# Altium project KlusterLab r2.0.PrjPcb (part 5 of 10)

## Sheet SFP+_Connectors.SchDoc
size A3; SheetNumber: 16; SheetTotal: 22
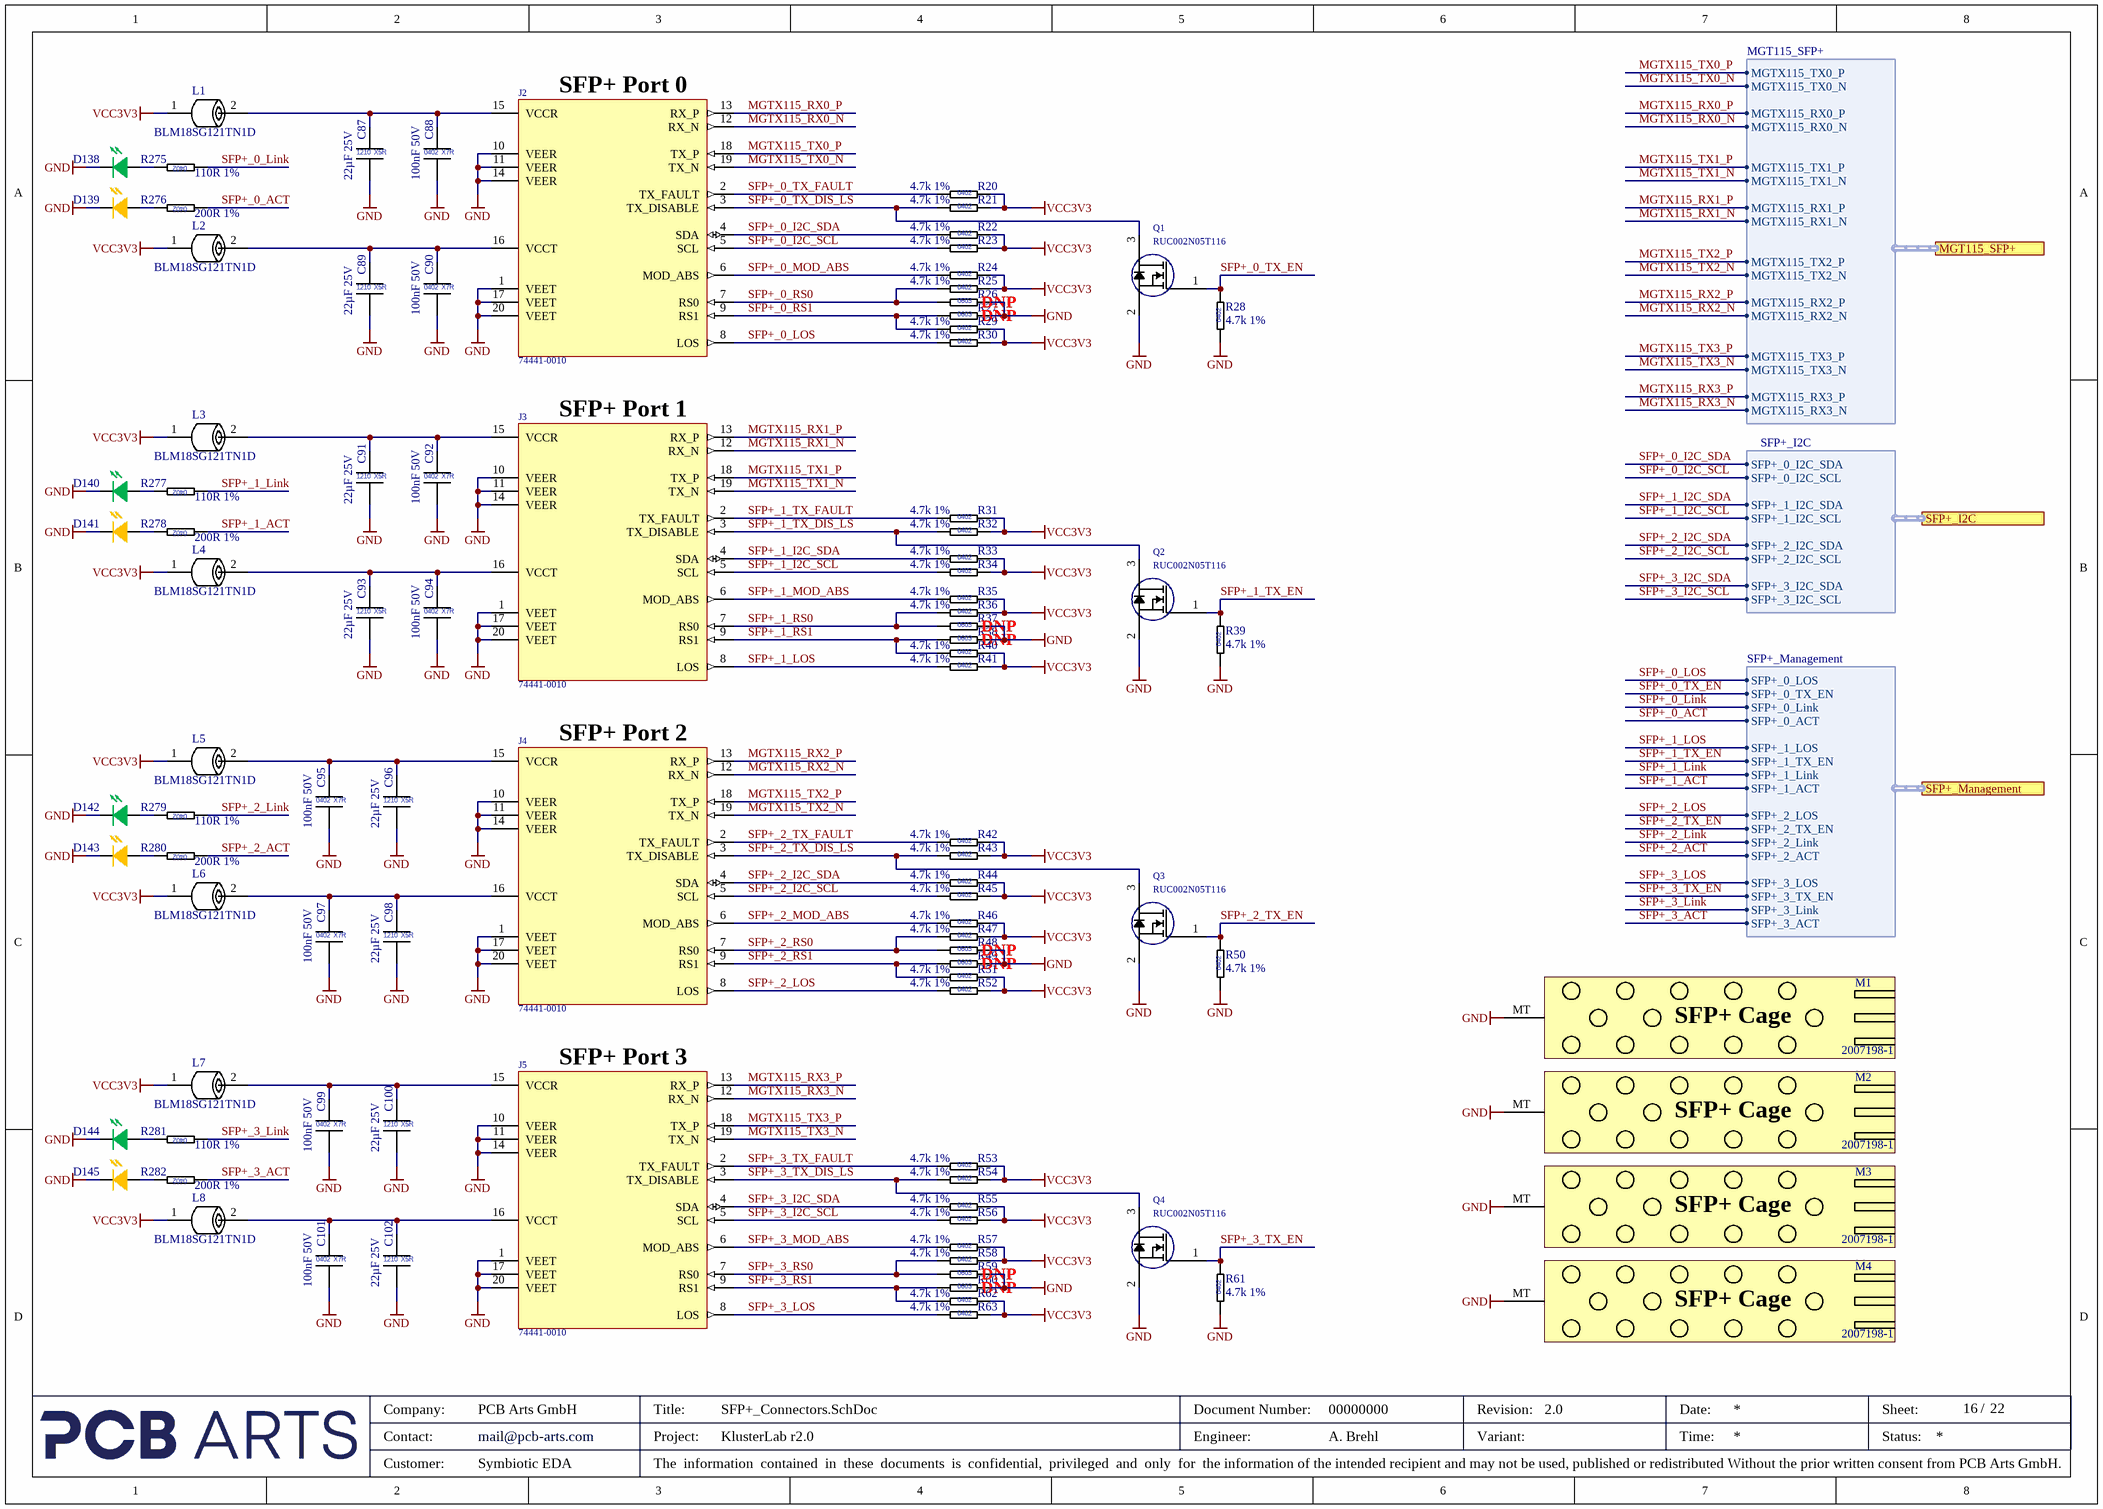
[diagram p9: SFP+_Connectors.SchDoc]

### Parts
C87  22µF 25V  [CAP_1210]
C88  100nF 50V  [CAP_0402_L]
C89  22µF 25V  [CAP_1210]
C90  100nF 50V  [CAP_0402_L]
C91  22µF 25V  [CAP_1210]
C92  100nF 50V  [CAP_0402_L]
C93  22µF 25V  [CAP_1210]
C94  100nF 50V  [CAP_0402_L]
C95  100nF 50V  [CAP_0402_L]
C96  22µF 25V  [CAP_1210]
C97  100nF 50V  [CAP_0402_L]
C98  22µF 25V  [CAP_1210]
C99  100nF 50V  [CAP_0402_L]
C100  22µF 25V  [CAP_1210]
C101  100nF 50V  [CAP_0402_L]
C102  22µF 25V  [CAP_1210]
D138  LTST-S270KGKT  [LED-0603 Sideview]  (value not drawn)
D139  LTST-S270KFKT  [LED-0603 Sideview]  (value not drawn)
D140  LTST-S270KGKT  [LED-0603 Sideview]  (value not drawn)
D141  LTST-S270KFKT  [LED-0603 Sideview]  (value not drawn)
D142  LTST-S270KGKT  [LED-0603 Sideview]  (value not drawn)
D143  LTST-S270KFKT  [LED-0603 Sideview]  (value not drawn)
D144  LTST-S270KGKT  [LED-0603 Sideview]  (value not drawn)
D145  LTST-S270KFKT  [LED-0603 Sideview]  (value not drawn)
J2  74441-0010  [74441-0010]
J3  74441-0010  [74441-0010]
J4  74441-0010  [74441-0010]
J5  74441-0010  [74441-0010]
L1  BLM18SG121TN1D  [L_0603]
L2  BLM18SG121TN1D  [L_0603]
L3  BLM18SG121TN1D  [L_0603]
L4  BLM18SG121TN1D  [L_0603]
L5  BLM18SG121TN1D  [L_0603]
L6  BLM18SG121TN1D  [L_0603]
L7  BLM18SG121TN1D  [L_0603]
L8  BLM18SG121TN1D  [L_0603]
M1  2007198-1  [2007198-1]
M2  2007198-1  [2007198-1]
M3  2007198-1  [2007198-1]
M4  2007198-1  [2007198-1]
Q1  RUC002N05T116  [SOT95P251X112-3N]
Q2  RUC002N05T116  [SOT95P251X112-3N]
Q3  RUC002N05T116  [SOT95P251X112-3N]
Q4  RUC002N05T116  [SOT95P251X112-3N]
R20  4.7k 1%  [RES_0402_L]
R21  4.7k 1%  [RES_0402_L]
R22  4.7k 1%  [RES_0402_L]
R23  4.7k 1%  [RES_0402_L]
R24  4.7k 1%  [RES_0402_L]
R25  4.7k 1%  [RES_0402_L]
R26  0R Jumper  [RES_0603_L]  (value not drawn)  (no BOM)
R27  0R Jumper  [RES_0603_L]  (value not drawn)  (no BOM)
R28  4.7k 1%  [RES_0402_L]
R29  4.7k 1%  [RES_0402_L]
R30  4.7k 1%  [RES_0402_L]
R31  4.7k 1%  [RES_0402_L]
R32  4.7k 1%  [RES_0402_L]
R33  4.7k 1%  [RES_0402_L]
R34  4.7k 1%  [RES_0402_L]
R35  4.7k 1%  [RES_0402_L]
R36  4.7k 1%  [RES_0402_L]
R37  0R Jumper  [RES_0603_L]  (value not drawn)  (no BOM)
R38  0R Jumper  [RES_0603_L]  (value not drawn)  (no BOM)
R39  4.7k 1%  [RES_0402_L]
R40  4.7k 1%  [RES_0402_L]
R41  4.7k 1%  [RES_0402_L]
R42  4.7k 1%  [RES_0402_L]
R43  4.7k 1%  [RES_0402_L]
R44  4.7k 1%  [RES_0402_L]
R45  4.7k 1%  [RES_0402_L]
R46  4.7k 1%  [RES_0402_L]
R47  4.7k 1%  [RES_0402_L]
R48  0R Jumper  [RES_0603_L]  (value not drawn)  (no BOM)
R49  0R Jumper  [RES_0603_L]  (value not drawn)  (no BOM)
R50  4.7k 1%  [RES_0402_L]
R51  4.7k 1%  [RES_0402_L]
R52  4.7k 1%  [RES_0402_L]
R53  4.7k 1%  [RES_0402_L]
R54  4.7k 1%  [RES_0402_L]
R55  4.7k 1%  [RES_0402_L]
R56  4.7k 1%  [RES_0402_L]
R57  4.7k 1%  [RES_0402_L]
R58  4.7k 1%  [RES_0402_L]
R59  0R Jumper  [RES_0603_L]  (value not drawn)  (no BOM)
R60  0R Jumper  [RES_0603_L]  (value not drawn)  (no BOM)
R61  4.7k 1%  [RES_0402_L]
R62  4.7k 1%  [RES_0402_L]
R63  4.7k 1%  [RES_0402_L]
R275  110R 1%  [RES_0402_L]
R276  200R 1%  [RES_0402_L]
R277  110R 1%  [RES_0402_L]
R278  200R 1%  [RES_0402_L]
R279  110R 1%  [RES_0402_L]
R280  200R 1%  [RES_0402_L]
R281  110R 1%  [RES_0402_L]
R282  200R 1%  [RES_0402_L]

### Ports
MGT115_SFP+ (harness MGT115_SFP+, see Top-Level-Sheet[6B], MGT Banks 115-116[8A]), SFP+_I2C (harness SFP+_I2C, see Top-Level-Sheet[6B], I2C Multiplexer[7A]), SFP+_Management (harness SFP+_Management, see Top-Level-Sheet[6B], Bank 13_Bank 15_Bank 16[8C])

### Harnesses
MGT115_SFP+: MGTX115_TX0_P, MGTX115_TX0_N, MGTX115_RX0_P, MGTX115_RX0_N, MGTX115_TX1_P, MGTX115_TX1_N, MGTX115_RX1_P, MGTX115_RX1_N, MGTX115_TX2_P, MGTX115_TX2_N, MGTX115_RX2_P, MGTX115_RX2_N, MGTX115_TX3_P, MGTX115_TX3_N, MGTX115_RX3_P, MGTX115_RX3_N
SFP+_I2C: SFP+_3_I2C_SDA, SFP+_3_I2C_SCL, SFP+_0_I2C_SDA, SFP+_0_I2C_SCL, SFP+_1_I2C_SDA, SFP+_1_I2C_SCL, SFP+_2_I2C_SDA, SFP+_2_I2C_SCL
SFP+_Management: SFP+_0_LOS, SFP+_0_TX_EN, SFP+_0_Link, SFP+_0_ACT, SFP+_1_LOS, SFP+_1_TX_EN, SFP+_1_Link, SFP+_1_ACT, SFP+_2_LOS, SFP+_2_TX_EN, SFP+_2_Link, SFP+_2_ACT, SFP+_3_LOS, SFP+_3_TX_EN, SFP+_3_Link, SFP+_3_ACT

### Nets
GND: C87.2 C88.2 C89.2 C90.2 C91.2 C92.2 C93.2 C94.2 C95.2 C96.2 C97.2 C98.2 C99.2 C100.2 C101.2 C102.2 D138.1 D139.1 D140.1 D141.1 D142.1 D143.1 D144.1 D145.1 J2.1(VEET) J2.10(VEER) J2.11(VEER) J2.14(VEER) J2.17(VEET) J2.20(VEET) J3.1(VEET) J3.10(VEER) J3.11(VEER) J3.14(VEER) J3.17(VEET) J3.20(VEET) J4.1(VEET) J4.10(VEER) J4.11(VEER) J4.14(VEER) J4.17(VEET) J4.20(VEET) J5.1(VEET) J5.10(VEER) J5.11(VEER) J5.14(VEER) J5.17(VEET) J5.20(VEET) M1.MT M2.MT M3.MT M4.MT Q1.2(D) Q2.2(D) Q3.2(D) Q4.2(D) R26.2 R27.2 R28.1 R37.2 R38.2 R39.1 R48.2 R49.2 R50.1 R59.2 R60.2 R61.1
VCC3V3: L1.1 L2.1 L3.1 L4.1 L5.1 L6.1 L7.1 L8.1 R20.2 R21.2 R22.2 R23.2 R24.2 R25.2 R29.2 R30.2 R31.2 R32.2 R33.2 R34.2 R35.2 R36.2 R40.2 R41.2 R42.2 R43.2 R44.2 R45.2 R46.2 R47.2 R51.2 R52.2 R53.2 R54.2 R55.2 R56.2 R57.2 R58.2 R62.2 R63.2
MGTX115_RX0_N: J2.12(RX_N) ; port MGT115_SFP+.MGTX115_RX0_N
MGTX115_RX0_P: J2.13(RX_P) ; port MGT115_SFP+.MGTX115_RX0_P
MGTX115_RX1_N: J3.12(RX_N) ; port MGT115_SFP+.MGTX115_RX1_N
MGTX115_RX1_P: J3.13(RX_P) ; port MGT115_SFP+.MGTX115_RX1_P
MGTX115_RX2_N: J4.12(RX_N) ; port MGT115_SFP+.MGTX115_RX2_N
MGTX115_RX2_P: J4.13(RX_P) ; port MGT115_SFP+.MGTX115_RX2_P
MGTX115_RX3_N: J5.12(RX_N) ; port MGT115_SFP+.MGTX115_RX3_N
MGTX115_RX3_P: J5.13(RX_P) ; port MGT115_SFP+.MGTX115_RX3_P
MGTX115_TX0_N: J2.19(TX_N) ; port MGT115_SFP+.MGTX115_TX0_N
MGTX115_TX0_P: J2.18(TX_P) ; port MGT115_SFP+.MGTX115_TX0_P
MGTX115_TX1_N: J3.19(TX_N) ; port MGT115_SFP+.MGTX115_TX1_N
MGTX115_TX1_P: J3.18(TX_P) ; port MGT115_SFP+.MGTX115_TX1_P
MGTX115_TX2_N: J4.19(TX_N) ; port MGT115_SFP+.MGTX115_TX2_N
MGTX115_TX2_P: J4.18(TX_P) ; port MGT115_SFP+.MGTX115_TX2_P
MGTX115_TX3_N: J5.19(TX_N) ; port MGT115_SFP+.MGTX115_TX3_N
MGTX115_TX3_P: J5.18(TX_P) ; port MGT115_SFP+.MGTX115_TX3_P
SFP+_0_ACT: R276.1 ; port SFP+_Management.SFP+_0_ACT
SFP+_0_I2C_SCL: J2.5(SCL) R23.1 ; port SFP+_I2C.SFP+_0_I2C_SCL
SFP+_0_I2C_SDA: J2.4(SDA) R22.1 ; port SFP+_I2C.SFP+_0_I2C_SDA
SFP+_0_Link: R275.1 ; port SFP+_Management.SFP+_0_Link
SFP+_0_LOS: J2.8(LOS) R30.1 ; port SFP+_Management.SFP+_0_LOS
SFP+_0_MOD_ABS: J2.6(MOD_ABS) R24.1
SFP+_0_RS0: J2.7(RS0) R25.1 R26.1
SFP+_0_RS1: J2.9(RS1) R27.1 R29.1
SFP+_0_TX_DIS_LS: J2.3(TX_DISABLE) Q1.3(S) R21.1
SFP+_0_TX_EN: Q1.1(G) R28.2 ; port SFP+_Management.SFP+_0_TX_EN
SFP+_0_TX_FAULT: J2.2(TX_FAULT) R20.1
SFP+_1_ACT: R278.1 ; port SFP+_Management.SFP+_1_ACT
SFP+_1_I2C_SCL: J3.5(SCL) R34.1 ; port SFP+_I2C.SFP+_1_I2C_SCL
SFP+_1_I2C_SDA: J3.4(SDA) R33.1 ; port SFP+_I2C.SFP+_1_I2C_SDA
SFP+_1_Link: R277.1 ; port SFP+_Management.SFP+_1_Link
SFP+_1_LOS: J3.8(LOS) R41.1 ; port SFP+_Management.SFP+_1_LOS
SFP+_1_MOD_ABS: J3.6(MOD_ABS) R35.1
SFP+_1_RS0: J3.7(RS0) R36.1 R37.1
SFP+_1_RS1: J3.9(RS1) R38.1 R40.1
SFP+_1_TX_DIS_LS: J3.3(TX_DISABLE) Q2.3(S) R32.1
SFP+_1_TX_EN: Q2.1(G) R39.2 ; port SFP+_Management.SFP+_1_TX_EN
SFP+_1_TX_FAULT: J3.2(TX_FAULT) R31.1
SFP+_2_ACT: R280.1 ; port SFP+_Management.SFP+_2_ACT
SFP+_2_I2C_SCL: J4.5(SCL) R45.1 ; port SFP+_I2C.SFP+_2_I2C_SCL
SFP+_2_I2C_SDA: J4.4(SDA) R44.1 ; port SFP+_I2C.SFP+_2_I2C_SDA
SFP+_2_Link: R279.1 ; port SFP+_Management.SFP+_2_Link
SFP+_2_LOS: J4.8(LOS) R52.1 ; port SFP+_Management.SFP+_2_LOS
SFP+_2_MOD_ABS: J4.6(MOD_ABS) R46.1
SFP+_2_RS0: J4.7(RS0) R47.1 R48.1
SFP+_2_RS1: J4.9(RS1) R49.1 R51.1
SFP+_2_TX_DIS_LS: J4.3(TX_DISABLE) Q3.3(S) R43.1
SFP+_2_TX_EN: Q3.1(G) R50.2 ; port SFP+_Management.SFP+_2_TX_EN
SFP+_2_TX_FAULT: J4.2(TX_FAULT) R42.1
SFP+_3_ACT: R282.1 ; port SFP+_Management.SFP+_3_ACT
SFP+_3_I2C_SCL: J5.5(SCL) R56.1 ; port SFP+_I2C.SFP+_3_I2C_SCL
SFP+_3_I2C_SDA: J5.4(SDA) R55.1 ; port SFP+_I2C.SFP+_3_I2C_SDA
SFP+_3_Link: R281.1 ; port SFP+_Management.SFP+_3_Link
SFP+_3_LOS: J5.8(LOS) R63.1 ; port SFP+_Management.SFP+_3_LOS
SFP+_3_MOD_ABS: J5.6(MOD_ABS) R57.1
SFP+_3_RS0: J5.7(RS0) R58.1 R59.1
SFP+_3_RS1: J5.9(RS1) R60.1 R62.1
SFP+_3_TX_DIS_LS: J5.3(TX_DISABLE) Q4.3(S) R54.1
SFP+_3_TX_EN: Q4.1(G) R61.2 ; port SFP+_Management.SFP+_3_TX_EN
SFP+_3_TX_FAULT: J5.2(TX_FAULT) R53.1
NetC87_1: C87.1 C88.1 J2.15(VCCR) L1.2
NetC89_1: C89.1 C90.1 J2.16(VCCT) L2.2
NetC91_1: C91.1 C92.1 J3.15(VCCR) L3.2
NetC93_1: C93.1 C94.1 J3.16(VCCT) L4.2
NetC95_1: C95.1 C96.1 J4.15(VCCR) L5.2
NetC97_1: C97.1 C98.1 J4.16(VCCT) L6.2
NetC99_1: C99.1 C100.1 J5.15(VCCR) L7.2
NetC101_1: C101.1 C102.1 J5.16(VCCT) L8.2
NetD138_2: D138.2 R275.2
NetD139_2: D139.2 R276.2
NetD140_2: D140.2 R277.2
NetD141_2: D141.2 R278.2
NetD142_2: D142.2 R279.2
NetD143_2: D143.2 R280.2
NetD144_2: D144.2 R281.2
NetD145_2: D145.2 R282.2

### Notes on the sheet
- (near J2) SFP+ Port 0
- DNP
- (near J3) SFP+ Port 1
- (near J4) SFP+ Port 2
- (near J5) SFP+ Port 3
- Company:
- Contact:
- Customer:
- mail@pcb-arts.com
- PCB Arts GmbH
- Title:
- Project:
- The  information  contained  in  these  documents  is  confidential,  privileged  and  only  for  the information of the intended recipient and may not be used, published or redistributed Without the prior written consent from PCB Arts GmbH.
- Engineer:
- Document Number:
- Revision:
- Variant:
- Date:
- Time:
- Sheet:
- Status:
- /
- (in symbol 2007198-1_2SFP+ Cage, 1x1, external EMV springs, no lightpipes) SFP+ Cage
- (in symbol CAP_0402_100nF_50V) 0402; X7R
- (in symbol CAP_1210_22µF_25V) 1210; X5R
- (in symbol RES_0402_4.7k_1%) 0402
- (in symbol RES_0402_110R_1%) 0402
- (in symbol RES_0402_200R 1%) 0402
- (in symbol RES_0603_0R_Jumper) 0603

### Library data of the parts
C87 C89 C91 C93 C96 C98 C100 C102 = CAP_1210_22µF_25V: Multilayer Ceramic Capacitors MLCC - SMD/SMT 1210 25VDC; Manufacturer 1: KEMET; Manufacturer 1 Prt. Nr.: C1210C226K3PACTU; Manufacturer 2 Prt. Nr.: TMK212BBJ226MG-TT; Manufacturer 2: Taiyo Yuden
C88 C90 C92 C94 C95 C97 C99 C101 = CAP_0402_100nF_50V: Multilayer Ceramic Capacitors MLCC - SMD/SMT 0402 50VDC; Manufacturer 1: Murata Electronics; Manufacturer 1 Prt. Nr.: GCM155L8EH104KE07D; Manufacturer 2 Prt. Nr.: UMK105B7104KV-FR; Manufacturer 2: TDK
D138 D140 D142 D144 = LED 0603 Green Sideview: GREEN  0603 Light Emitting Diode; Manufacturer 1: lite-On; Manufacturer 1 Prt. Nr.: LTST-S270KGKT; Color: Green
D139 D141 D143 D145 = LED 0603 ORANGE Sideview: ORANGE 0603 Light Emitting Diode; Manufacturer 1: lite-On; Manufacturer 1 Prt. Nr.: LTST-S270KFKT; Color: Orange
J2-J5 = 74441-0010_Card Edge Connector for SFP+: 20 Pin Right Angle 0.8mm SMD Card Edge Connector for SFP+; Manufacturer 1: Molex; Manufacturer 1 Prt. Nr.: 74441-0010
L1-L8 = BLM18SG121TN1D_Ferrite Beads 0603 120Ohms 3000mA: Ferritperlen BLM18_xN 0603 100MHz 120Ohm 3000mA 25mOhm RSER; Manufacturer 1: Murata Electronics; Manufacturer 1 Prt. Nr.: BLM18SG121TN1D
M1-M4 = 2007198-1_2SFP+ Cage, 1x1, external EMV springs, no lightpipes: 2SFP+ Cage, 1x1, external EMV springs, no lightpipes; Manufacturer 1: TE Connectivity; Manufacturer 1 Prt. Nr.: 2007198-1
Q1-Q4 = RUC002N05T116_MOSFET N-Ch 1.2 VGS Spec: MOSFET N-Ch 1.2 VGS Spec; Manufacturer 1: ROHM Semiconductor; Manufacturer 1 Prt. Nr.: RUC002N05T116
R20-R25 R28-R36 R39-R47 R50-R58 R61-R63 = RES_0402_4.7k_1%: Thick Film Resistors - SMD 4.7kOhm 1%; Manufacturer 1: Vishay / Dale; Manufacturer 1 Prt. Nr.: CRCW04024K70FKEDC; Manufacturer 2 Prt. Nr.: RC0402FR-134K7L; Manufacturer 2: Yageo
R26 R27 R37 R38 R48 R49 R59 R60 = RES_0603_0R_Jumper: Thick Film Resistors - SMD 0Ohm Jumper; Manufacturer 1: Yageo; Manufacturer 1 Prt. Nr.: RC0603JR-100RL; Manufacturer 2 Prt. Nr.: CRCW06030000Z0EBC; Manufacturer 2: Vishay / Draloric
R275 R277 R279 R281 = RES_0402_110R_1%: Thick Film Resistors - SMD 110Ohm 1%; Manufacturer 1: Vishay / Dale; Manufacturer 1 Prt. Nr.: CRCW0402110RFKTD; Manufacturer 2 Prt. Nr.: RC0402FR-7W110RL; Manufacturer 2: Yageo
R276 R278 R280 R282 = RES_0402_200R 1%: Thick Film Resistors - SMD 200Ohm 1%; Manufacturer 1: Vishay / Dale; Manufacturer 1 Prt. Nr.: CRCW0402200RFKEDC; Manufacturer 2 Prt. Nr.: AF0402FR-07200RL; Manufacturer 2: Yageo

## Sheet SMI Bank 12.SchDoc
size A3; SheetNumber: 26; SheetTotal: 32
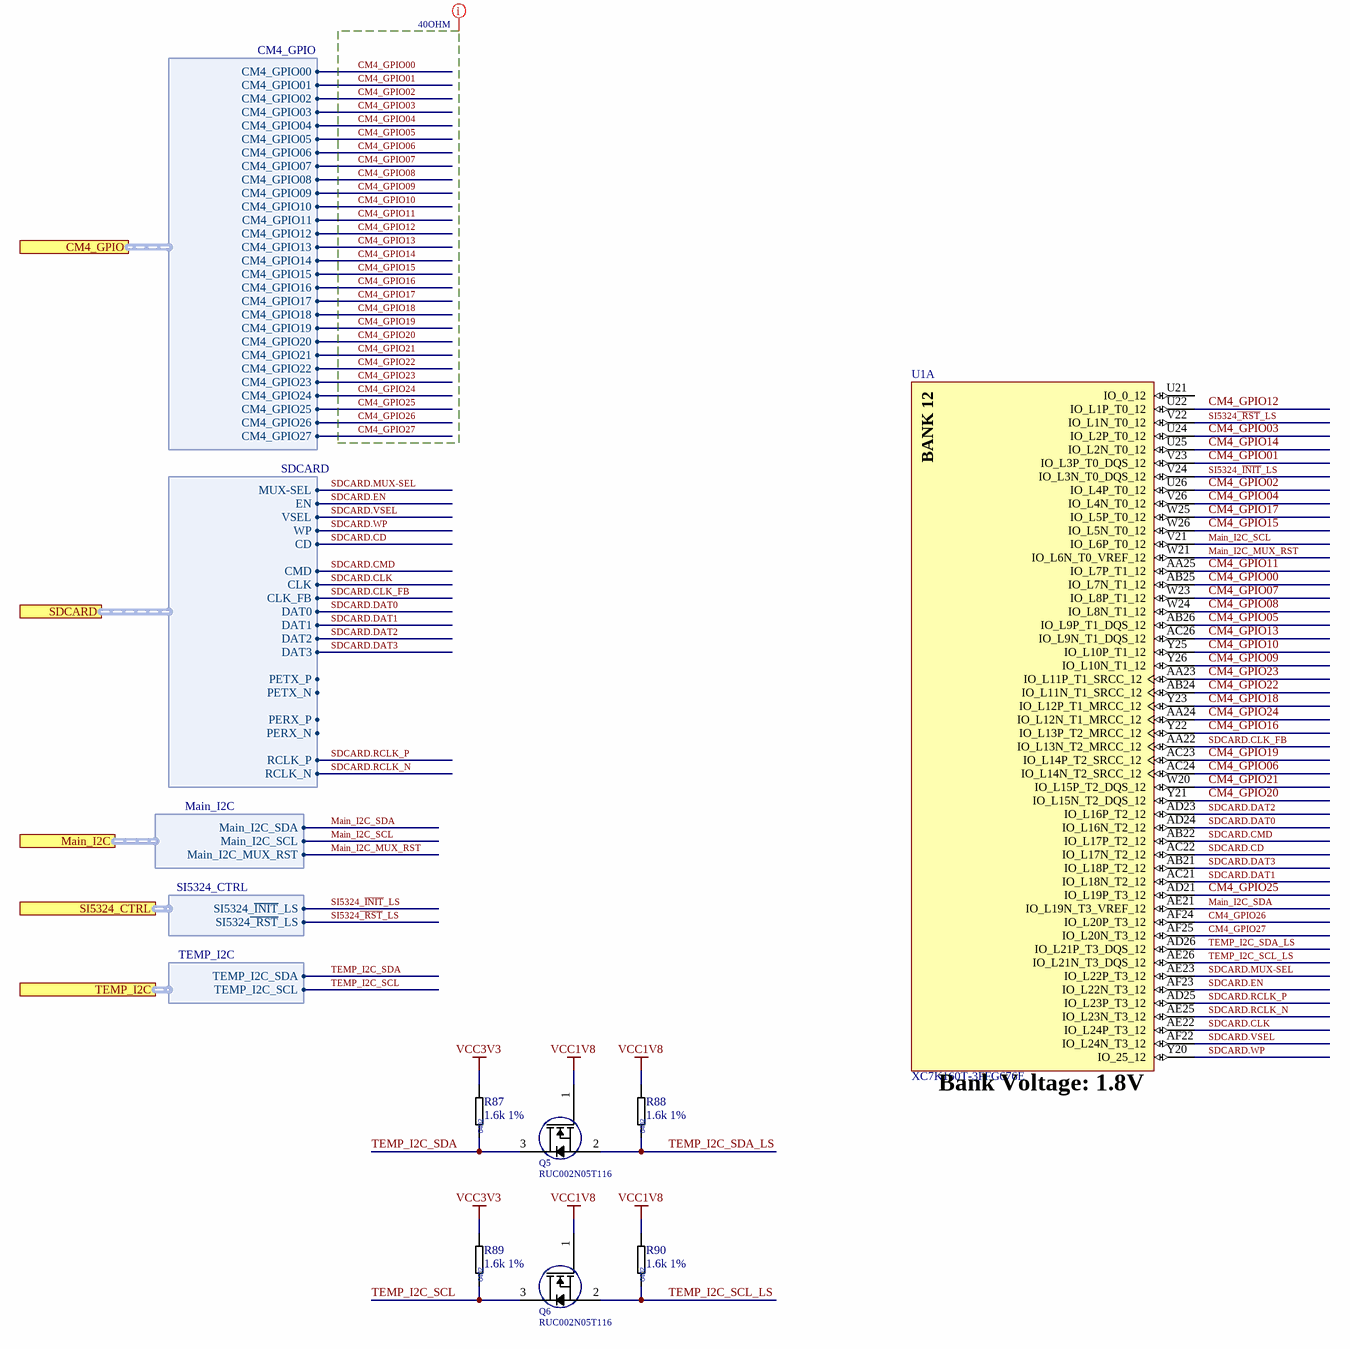
[diagram p10: SMI Bank 12.SchDoc]

### Parts
Q5  RUC002N05T116  [SOT95P251X112-3N]
Q6  RUC002N05T116  [SOT95P251X112-3N]
R87  1.6k 1%  [RES_0402_L]
R88  1.6k 1%  [RES_0402_L]
R89  1.6k 1%  [RES_0402_L]
R90  1.6k 1%  [RES_0402_L]
U1  XC7K160T-3FFG676E  [BGA100P2700X2700X317-676N]  (part A of 14)

### Ports
CM4_GPIO (harness CM4_GPIO, see Top-Level-Sheet[4B], Raspberry Pi CM4[8D]), Main_I2C (harness Main_I2C, see Top-Level-Sheet[4B], I2C Multiplexer[1A]), SDCARD (harness SDCARD, see Top-Level-Sheet[4B], Memory-SD_UHS_II[1C], MGT Banks 115-116[8B]), SI5324_CTRL (harness SI5324_CTRL, see Top-Level-Sheet[4B], System Clocks[1A]), TEMP_I2C (harness TEMP_I2C, see Top-Level-Sheet[4B], Power-Tree[1D])

### Harnesses
Main_I2C: Main_I2C_SCL, Main_I2C_MUX_RST, Main_I2C_SDA
SI5324_CTRL: SI5324_~{INIT}_LS, SI5324~{_RST}_LS
TEMP_I2C: TEMP_I2C_SCL, TEMP_I2C_SDA
CM4_GPIO: CM4_GPIO06, CM4_GPIO05, CM4_GPIO08, CM4_GPIO07, CM4_GPIO04, CM4_GPIO03, CM4_GPIO02, CM4_GPIO00, CM4_GPIO01, CM4_GPIO09, CM4_GPIO10, CM4_GPIO11, CM4_GPIO12, CM4_GPIO13, CM4_GPIO14, CM4_GPIO15, CM4_GPIO16, CM4_GPIO17, CM4_GPIO18, CM4_GPIO19, CM4_GPIO20, CM4_GPIO21, CM4_GPIO22, CM4_GPIO23, CM4_GPIO24, CM4_GPIO25, CM4_GPIO26, CM4_GPIO27
SDCARD: MUX-SEL, EN, VSEL, WP, CD, CMD, CLK, CLK_FB, PETX_P, PETX_N, DAT0, DAT1, DAT2, DAT3, PERX_P, PERX_N, RCLK_P, RCLK_N

### Nets
VCC1V8: Q5.1(G) Q6.1(G) R88.2 R90.2
VCC3V3: R87.2 R89.2
CM4_GPIO00: U1.AB25(IO_L7N_T1_12) ; port CM4_GPIO.CM4_GPIO00
CM4_GPIO01: U1.V23(IO_L3P_T0_DQS_12) ; port CM4_GPIO.CM4_GPIO01
CM4_GPIO02: U1.U26(IO_L4P_T0_12) ; port CM4_GPIO.CM4_GPIO02
CM4_GPIO03: U1.U24(IO_L2P_T0_12) ; port CM4_GPIO.CM4_GPIO03
CM4_GPIO04: U1.V26(IO_L4N_T0_12) ; port CM4_GPIO.CM4_GPIO04
CM4_GPIO05: U1.AB26(IO_L9P_T1_DQS_12) ; port CM4_GPIO.CM4_GPIO05
CM4_GPIO06: U1.AC24(IO_L14N_T2_SRCC_12) ; port CM4_GPIO.CM4_GPIO06
CM4_GPIO07: U1.W23(IO_L8P_T1_12) ; port CM4_GPIO.CM4_GPIO07
CM4_GPIO08: U1.W24(IO_L8N_T1_12) ; port CM4_GPIO.CM4_GPIO08
CM4_GPIO09: U1.Y26(IO_L10N_T1_12) ; port CM4_GPIO.CM4_GPIO09
CM4_GPIO10: U1.Y25(IO_L10P_T1_12) ; port CM4_GPIO.CM4_GPIO10
CM4_GPIO11: U1.AA25(IO_L7P_T1_12) ; port CM4_GPIO.CM4_GPIO11
CM4_GPIO12: U1.U22(IO_L1P_T0_12) ; port CM4_GPIO.CM4_GPIO12
CM4_GPIO13: U1.AC26(IO_L9N_T1_DQS_12) ; port CM4_GPIO.CM4_GPIO13
CM4_GPIO14: U1.U25(IO_L2N_T0_12) ; port CM4_GPIO.CM4_GPIO14
CM4_GPIO15: U1.W26(IO_L5N_T0_12) ; port CM4_GPIO.CM4_GPIO15
CM4_GPIO16: U1.Y22(IO_L13P_T2_MRCC_12) ; port CM4_GPIO.CM4_GPIO16
CM4_GPIO17: U1.W25(IO_L5P_T0_12) ; port CM4_GPIO.CM4_GPIO17
CM4_GPIO18: U1.Y23(IO_L12P_T1_MRCC_12) ; port CM4_GPIO.CM4_GPIO18
CM4_GPIO19: U1.AC23(IO_L14P_T2_SRCC_12) ; port CM4_GPIO.CM4_GPIO19
CM4_GPIO20: U1.Y21(IO_L15N_T2_DQS_12) ; port CM4_GPIO.CM4_GPIO20
CM4_GPIO21: U1.W20(IO_L15P_T2_DQS_12) ; port CM4_GPIO.CM4_GPIO21
CM4_GPIO22: U1.AB24(IO_L11N_T1_SRCC_12) ; port CM4_GPIO.CM4_GPIO22
CM4_GPIO23: U1.AA23(IO_L11P_T1_SRCC_12) ; port CM4_GPIO.CM4_GPIO23
CM4_GPIO24: U1.AA24(IO_L12N_T1_MRCC_12) ; port CM4_GPIO.CM4_GPIO24
CM4_GPIO25: U1.AD21(IO_L19P_T3_12) ; port CM4_GPIO.CM4_GPIO25
CM4_GPIO26: U1.AF24(IO_L20P_T3_12) ; port CM4_GPIO.CM4_GPIO26
CM4_GPIO27: U1.AF25(IO_L20N_T3_12) ; port CM4_GPIO.CM4_GPIO27
Main_I2C_MUX_RST: U1.W21(IO_L6N_T0_VREF_12) ; port Main_I2C.Main_I2C_MUX_RST
Main_I2C_SCL: U1.V21(IO_L6P_T0_12) ; port Main_I2C.Main_I2C_SCL
Main_I2C_SDA: U1.AE21(IO_L19N_T3_VREF_12) ; port Main_I2C.Main_I2C_SDA
SDCARD.CD: U1.AC22(IO_L17N_T2_12) ; port SDCARD.CD
SDCARD.CLK: U1.AE22(IO_L24P_T3_12) ; port SDCARD.CLK
SDCARD.CLK_FB: U1.AA22(IO_L13N_T2_MRCC_12) ; port SDCARD.CLK_FB
SDCARD.CMD: U1.AB22(IO_L17P_T2_12) ; port SDCARD.CMD
SDCARD.DAT0: U1.AD24(IO_L16N_T2_12) ; port SDCARD.DAT0
SDCARD.DAT1: U1.AC21(IO_L18N_T2_12) ; port SDCARD.DAT1
SDCARD.DAT2: U1.AD23(IO_L16P_T2_12) ; port SDCARD.DAT2
SDCARD.DAT3: U1.AB21(IO_L18P_T2_12) ; port SDCARD.DAT3
SDCARD.EN: U1.AF23(IO_L22N_T3_12) ; port SDCARD.EN
SDCARD.MUX-SEL: U1.AE23(IO_L22P_T3_12) ; port SDCARD.MUX-SEL
SDCARD.RCLK_N: U1.AE25(IO_L23N_T3_12) ; port SDCARD.RCLK_N
SDCARD.RCLK_P: U1.AD25(IO_L23P_T3_12) ; port SDCARD.RCLK_P
SDCARD.VSEL: U1.AF22(IO_L24N_T3_12) ; port SDCARD.VSEL
SDCARD.WP: U1.Y20(IO_25_12) ; port SDCARD.WP
SI5324~{_RST}_LS: U1.V22(IO_L1N_T0_12) ; port SI5324_CTRL.SI5324~{_RST}_LS
SI5324_~{INIT}_LS: U1.V24(IO_L3N_T0_DQS_12) ; port SI5324_CTRL.SI5324_~{INIT}_LS
TEMP_I2C_SCL: Q6.3(S) R89.1 ; port TEMP_I2C.TEMP_I2C_SCL
TEMP_I2C_SCL_LS: Q6.2(D) R90.1 U1.AE26(IO_L21N_T3_DQS_12)
TEMP_I2C_SDA: Q5.3(S) R87.1 ; port TEMP_I2C.TEMP_I2C_SDA
TEMP_I2C_SDA_LS: Q5.2(D) R88.1 U1.AD26(IO_L21P_T3_DQS_12)

Not connected (* = marked no-connect by the designer): U1 U21(IO_0_12)

### Layout directives
net class 40OHM: CM4_GPIO00, CM4_GPIO01, CM4_GPIO02, CM4_GPIO03, CM4_GPIO04, CM4_GPIO05, CM4_GPIO06, CM4_GPIO07, CM4_GPIO08, CM4_GPIO09, CM4_GPIO10, CM4_GPIO11, CM4_GPIO12, CM4_GPIO13, CM4_GPIO14, CM4_GPIO15, CM4_GPIO16, CM4_GPIO17, CM4_GPIO18, CM4_GPIO19, CM4_GPIO20, CM4_GPIO21, CM4_GPIO22, CM4_GPIO23, CM4_GPIO24, CM4_GPIO25, CM4_GPIO26, CM4_GPIO27

### Notes on the sheet
- (near U1) Bank Voltage: 1.8V
- Company:
- Contact:
- Customer:
- mail@pcb-arts.com
- PCB Arts GmbH
- Title:
- Project:
- The  information  contained  in  these  documents  is  confidential,  privileged  and  only  for  the information of the intended recipient and may not be used, published or redistributed Without the prior written consent from PCB Arts GmbH.
- Engineer:
- Document Number:
- Revision:
- Variant:
- Date:
- Time:
- Sheet:
- Status:
- /
- (in symbol RES_0402_1.6k_1%) 0402
- (in symbol XC7K160T-3FFG676E_Kintex-7 FPGA, 400 User I/Os, 8 GTX, FFG676, part A) BANK 12

### Library data of the parts
Q5 Q6 = RUC002N05T116_MOSFET N-Ch 1.2 VGS Spec: as Q1-Q4 on sheet SFP+_Connectors; Manufacturer 1 Prt. Nr.: RUC002N05T116
R87-R90 = RES_0402_1.6k_1%: Thick Film Resistors - SMD 1.6kOhm 1%; Manufacturer 1: Vishay / Dale; Manufacturer 1 Prt. Nr.: CRCW04021K60FKEDC; Manufacturer 2 Prt. Nr.: RC0402FR-7W1K6L; Manufacturer 2: Yageo
U1 = XC7K160T-3FFG676E_Kintex-7 FPGA, 400 User I/Os, 8 GTX, FFG676: Kintex-7 FPGA, 400 User I/Os, 8 GTX, 676-Ball BGA, Speed Grade 3, Extended Grade, Pb-Free; Manufacturer 1: Xilinx; Manufacturer 1 Prt. Nr.: XC7K160T-3FFG676E; ComponentLink1URL: http://www.xilinx.com/support/documentation/data_sheets/ds180_7Series_Overview.pdf; ComponentLink2URL: http://www.xilinx.com/support/documentation/user_guides/ug865-Zynq-7000-Pkg-Pinout.pdf; ComponentLink1Description: Datasheet; ComponentLink2Description: Package Specification

## Sheet SSD M.2_B-Key.SchDoc
size A3; SheetNumber: 28; SheetTotal: 31
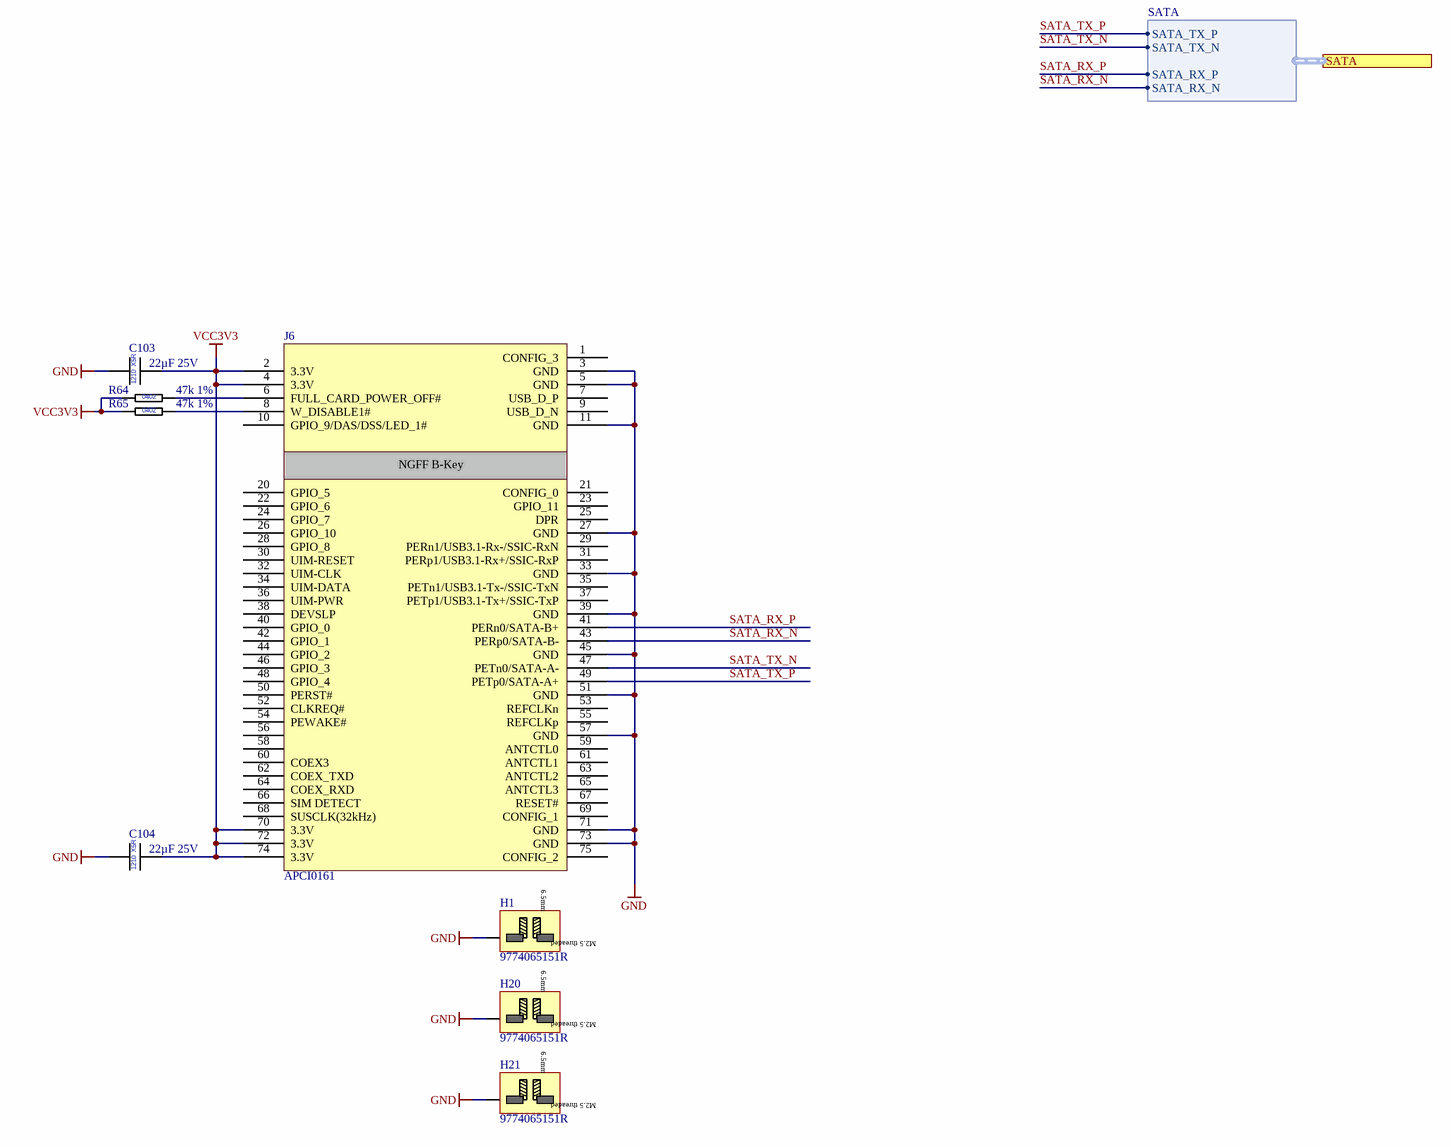
[diagram p11: SSD M.2_B-Key.SchDoc]

### Parts
C103  22µF 25V  [CAP_1210]
C104  22µF 25V  [CAP_1210]
H1  9774065151R  [9774065151R]
H20  9774065151R  [9774065151R]
H21  9774065151R  [9774065151R]
J6  APCI0161  [APCI0161-P001A]
R64  47k 1%  [RES_0402_L]
R65  47k 1%  [RES_0402_L]

### Ports
SATA (harness SATA, see Top-Level-Sheet[6B], MGT Banks 115-116[8C])

### Harnesses
SATA: SATA_TX_P, SATA_TX_N, SATA_RX_P, SATA_RX_N

### Nets
GND: C103.1 C104.1 H1.1 H20.1 H21.1 J6.3(GND) J6.5(GND) J6.11(GND) J6.27(GND) J6.33(GND) J6.39(GND) J6.45(GND) J6.51(GND) J6.57(GND) J6.71(GND) J6.73(GND)
VCC3V3: C103.2 C104.2 J6.2(3.3V) J6.4(3.3V) J6.70(3.3V) J6.72(3.3V) J6.74(3.3V) R64.1 R65.1
SATA_RX_N: J6.43(PERp0/SATA-B-) ; port SATA.SATA_RX_N
SATA_RX_P: J6.41(PERn0/SATA-B+) ; port SATA.SATA_RX_P
SATA_TX_N: J6.47(PETn0/SATA-A-) ; port SATA.SATA_TX_N
SATA_TX_P: J6.49(PETp0/SATA-A+) ; port SATA.SATA_TX_P
NetJ6_6: J6.6(FULL_CARD_POWER_OFF#) R64.2
NetJ6_8: J6.8(W_DISABLE1#) R65.2

Not connected (* = marked no-connect by the designer): J6 1(CONFIG_3) 7(USB_D_P) 9(USB_D_N) 10(GPIO_9/DAS/DSS/LED_1#) 20(GPIO_5) 21(CONFIG_0) 22(GPIO_6) 23(GPIO_11) 24(GPIO_7) 25(DPR) 26(GPIO_10) 28(GPIO_8) 29(PERn1/USB3.1-Rx-/SSIC-RxN) 30(UIM-RESET) 31(PERp1/USB3.1-Rx+/SSIC-RxP) 32(UIM-CLK) 34(UIM-DATA) 35(PETn1/USB3.1-Tx-/SSIC-TxN) 36(UIM-PWR) 37(PETp1/USB3.1-Tx+/SSIC-TxP) 38(DEVSLP) 40(GPIO_0) 42(GPIO_1) 44(GPIO_2) 46(GPIO_3) 48(GPIO_4) 50(PERST#) 52(CLKREQ#) 53(REFCLKn) 54(PEWAKE#) 55(REFCLKp) 56 58 59(ANTCTL0) 60(COEX3) 61(ANTCTL1) 62(COEX_TXD) 63(ANTCTL2) 64(COEX_RXD) 65(ANTCTL3) 66(SIM_DETECT) 67(RESET#) 68(SUSCLK(32kHz)) 69(CONFIG_1) 75(CONFIG_2)

### Notes on the sheet
- Company:
- Contact:
- Customer:
- mail@pcb-arts.com
- PCB Arts GmbH
- Title:
- Project:
- The  information  contained  in  these  documents  is  confidential,  privileged  and  only  for  the information of the intended recipient and may not be used, published or redistributed Without the prior written consent from PCB Arts GmbH.
- Engineer:
- Document Number:
- Revision:
- Variant:
- Date:
- Time:
- Sheet:
- Status:
- /
- (in symbol APCI0161-NGFF B-Key Card Edge Connector 8.5mm Height) NGFF B-Key
- (in symbol CAP_1210_22µF_25V) X5R; 1210
- (in symbol RES_0402_47k_1%) 0402
- (in symbol Würth Standoff M2.5 h:6.5mm) 6.5mm; M2.5 threaded

### Library data of the parts
C103 C104 = CAP_1210_22µF_25V: as C87 on sheet SFP+_Connectors; Manufacturer 2: Taiyo Yuden
H1 H20 H21 = Würth Standoff M2.5 h:6.5mm: Würth Standoff M2.5 h:6.5mm 9774065151R; Manufacturer 1: Würth Elektronik; Manufacturer 1 Prt. Nr.: 9774065151R
J6 = APCI0161-NGFF B-Key Card Edge Connector 8.5mm Height: NGFF B-Key Card Edge Connector 8.5mm Height; Manufacturer 1: Lotes; Manufacturer 1 Prt. Nr.: APCI0161
R64 R65 = RES_0402_47k_1%: Thick Film Resistors - SMD 47kOhm 1%; Manufacturer 1: Vishay / Dale; Manufacturer 1 Prt. Nr.: CRCW040247K0FKEDC; Manufacturer 2 Prt. Nr.: RC0402FR-7W47KL; Manufacturer 2: Yageo

## Sheet USB-HUB-MUX.SchDoc
size A3; SheetNumber: 30; SheetTotal: 32
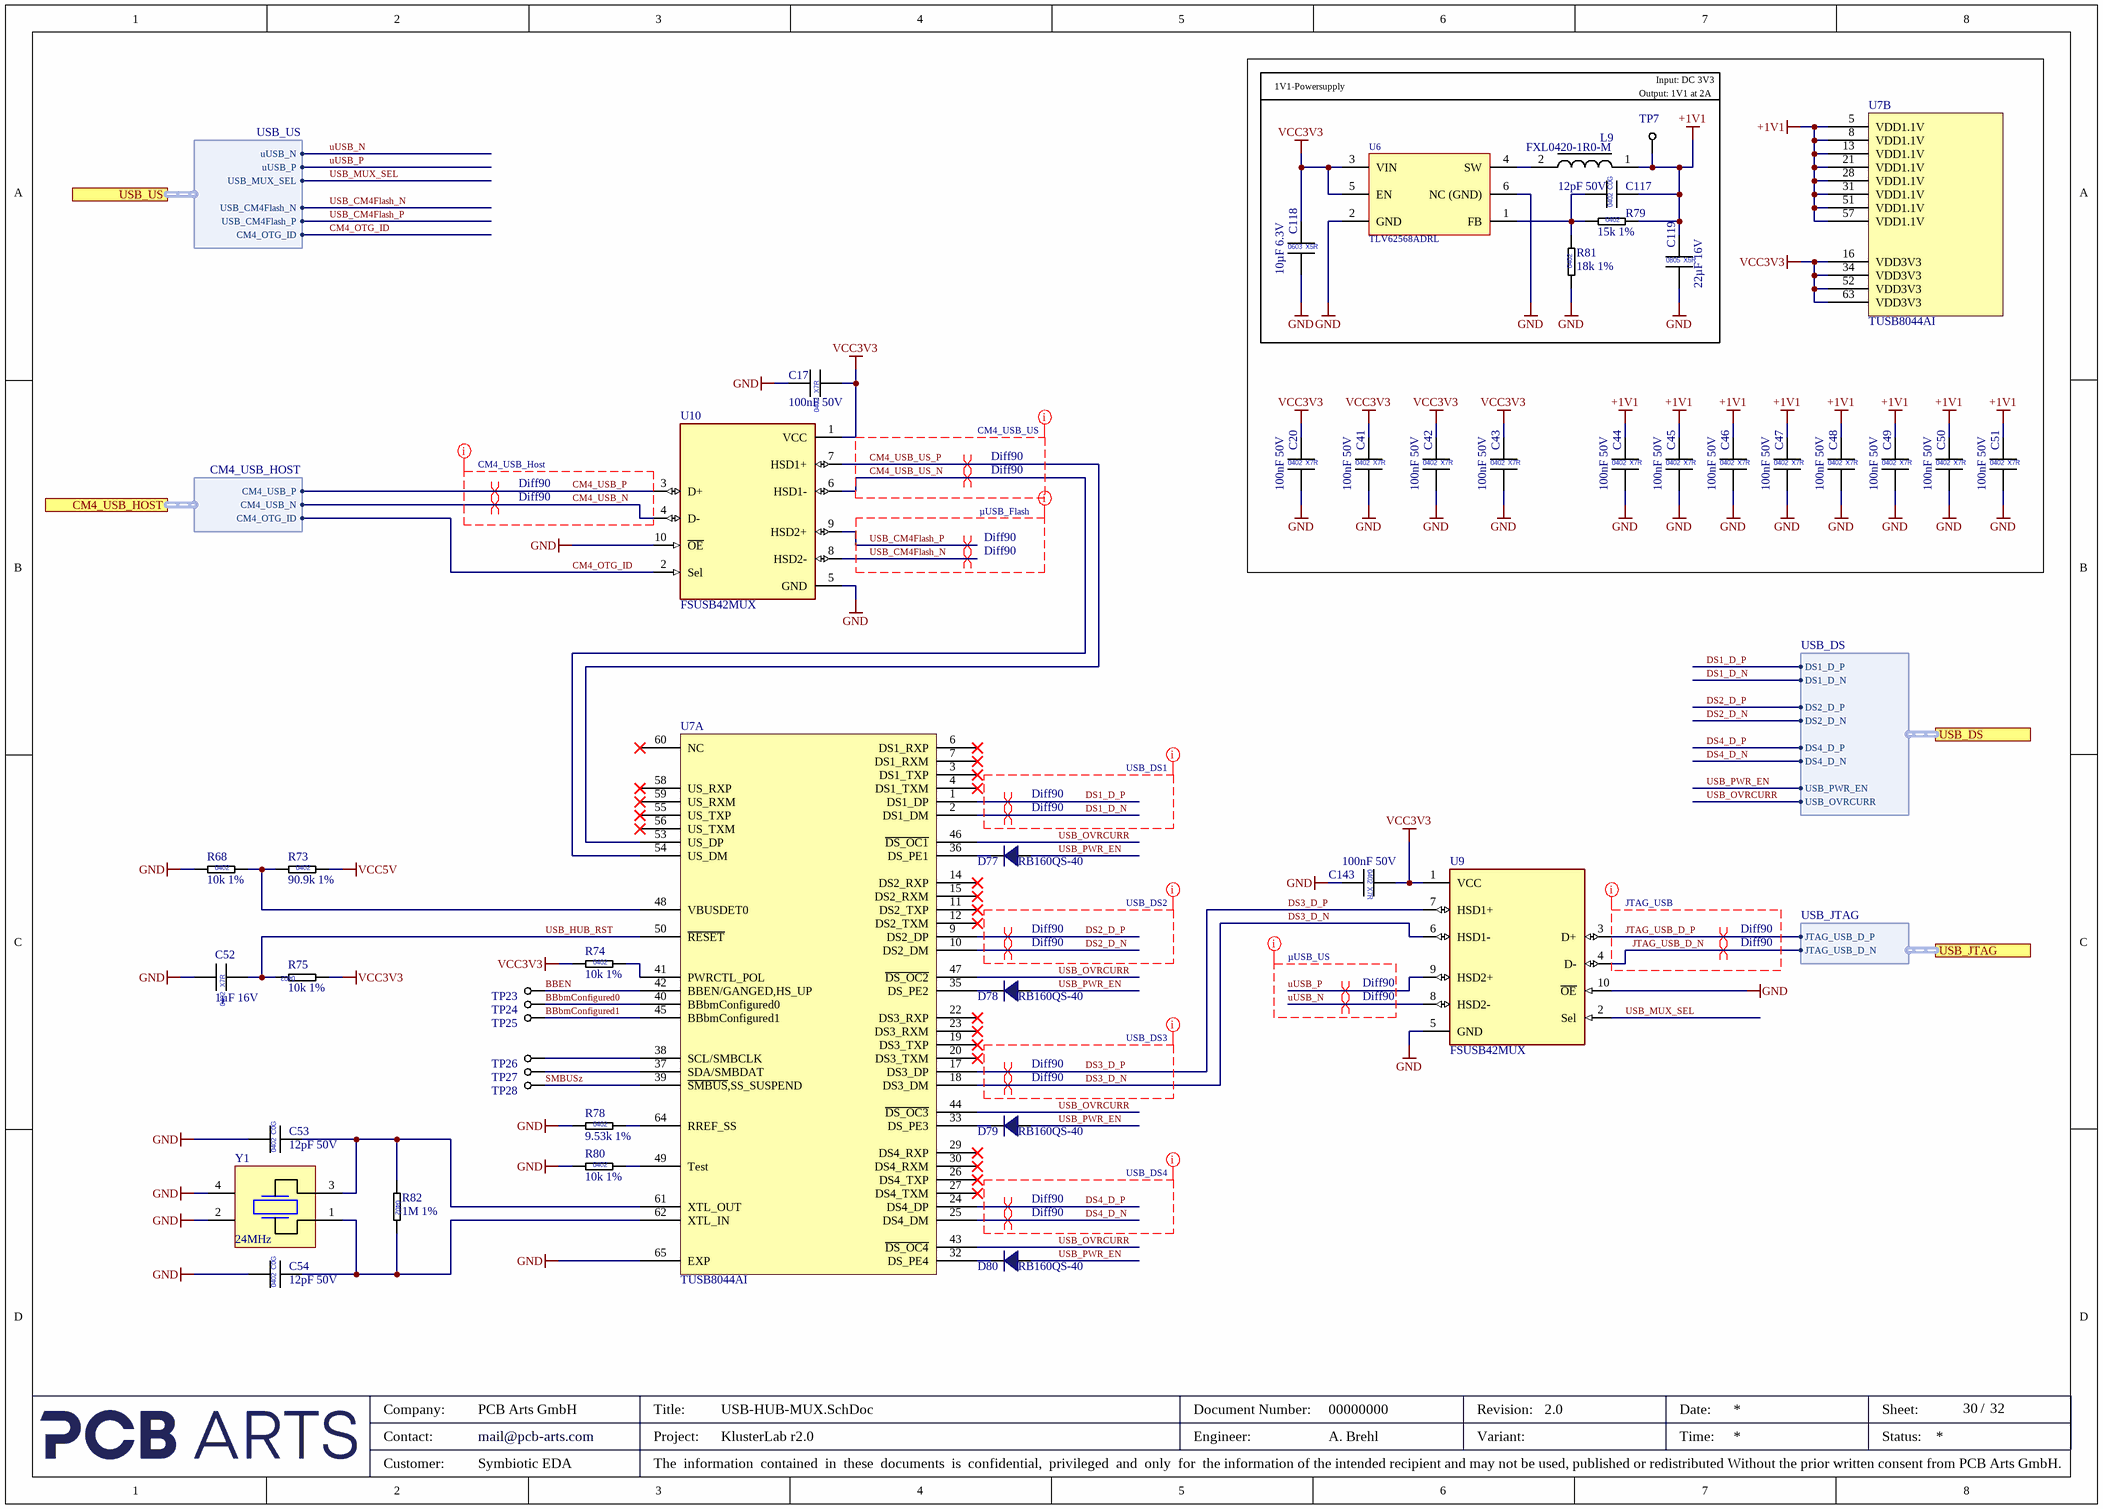
[diagram p12: USB-HUB-MUX.SchDoc]

### Parts
C17  100nF 50V  [CAP_0402_L]
C20  100nF 50V  [CAP_0402_L]
C41  100nF 50V  [CAP_0402_L]
C42  100nF 50V  [CAP_0402_L]
C43  100nF 50V  [CAP_0402_L]
C44  100nF 50V  [CAP_0402_L]
C45  100nF 50V  [CAP_0402_L]
C46  100nF 50V  [CAP_0402_L]
C47  100nF 50V  [CAP_0402_L]
C48  100nF 50V  [CAP_0402_L]
C49  100nF 50V  [CAP_0402_L]
C50  100nF 50V  [CAP_0402_L]
C51  100nF 50V  [CAP_0402_L]
C52  1µF 16V  [CAP_0402_L]
C53  12pF 50V  [CAP_0402_L]
C54  12pF 50V  [CAP_0402_L]
C117  12pF 50V  [CAP_0402_L]
C118  10µF 6.3V  [CAP_0603_L]
C119  22µF 16V  [CAP_0805]
C143  100nF 50V  [CAP_0402_L]
D77  RB160QS-40  [SOD-882]
D78  RB160QS-40  [SOD-882]
D79  RB160QS-40  [SOD-882]
D80  RB160QS-40  [SOD-882]
L9  FXL0420-1R0-M  [FXL0420-1R0-M]
R68  10k 1%  [RES_0402_L]
R73  90.9k 1%  [RES_0402_L]
R74  10k 1%  [RES_0402_L]
R75  10k 1%  [RES_0402_L]
R78  9.53k 1%  [RES_0402_L]
R79  15k 1%  [RES_0402_L]
R80  10k 1%  [RES_0402_L]
R81  18k 1%  [RES_0402_L]
R82  1M 1%  [RES_0402_L]
TP7  Testpoint  [Testpoint 0.8mm]  (value not drawn)  (no BOM)
TP23  Testpoint  [Testpoint 0.8mm]  (value not drawn)  (no BOM)
TP24  Testpoint  [Testpoint 0.8mm]  (value not drawn)  (no BOM)
TP25  Testpoint  [Testpoint 0.8mm]  (value not drawn)  (no BOM)
TP26  Testpoint  [Testpoint 0.8mm]  (value not drawn)  (no BOM)
TP27  Testpoint  [Testpoint 0.8mm]  (value not drawn)  (no BOM)
TP28  Testpoint  [Testpoint 0.8mm]  (value not drawn)  (no BOM)
U6  TLV62568ADRL  [SON50P150X80-6N]
U7  TUSB8044AI  [QFN50P900X900X90_HS-65N]  (parts A,B of 2)
U9  FSUSB42MUX  [SOP50P300X300X110-10N]
U10  FSUSB42MUX  [SOP50P300X300X110-10N]
Y1  Frequency: 24MHz  [ECX-2236B]  (hidden comment: ECS-240-10-36B2-CTN-TR)

### Ports
CM4_USB_HOST (harness CM4_USB_HOST, see Top-Level-Sheet[3B], Raspberry Pi CM4[8C]), USB_DS (harness USB_DS, see Top-Level-Sheet[3B], USB Connectors[8A]), USB_JTAG (harness USB_JTAG, see Top-Level-Sheet[3B], Bank 0_Bank 14[8A]), USB_US (harness USB_US, see Top-Level-Sheet[3B], USB Connectors[4B])

### Harnesses
CM4_USB_HOST: CM4_USB_P, CM4_USB_N, CM4_OTG_ID
USB_JTAG: JTAG_USB_D_P, JTAG_USB_D_N
USB_DS: DS1_D_P, DS1_D_N, DS2_D_P, DS2_D_N, DS4_D_P, DS4_D_N, USB_PWR_EN, USB_OVRCURR
USB_US: USB_MUX_SEL, uUSB_N, uUSB_P, CM4_OTG_ID, USB_CM4Flash_N, USB_CM4Flash_P

### Nets
+1V1: C44.1 C45.1 C46.1 C47.1 C48.1 C49.1 C50.1 C51.1 C117.2 C119.1 L9.1 R79.2 TP7.1(GND) U7.5(VDD1.1V) U7.8(VDD1.1V) U7.13(VDD1.1V) U7.21(VDD1.1V) U7.28(VDD1.1V) U7.31(VDD1.1V) U7.51(VDD1.1V) U7.57(VDD1.1V)
GND: C17.2 C20.2 C41.2 C42.2 C43.2 C44.2 C45.2 C46.2 C47.2 C48.2 C49.2 C50.2 C51.2 C52.2 C53.1 C54.1 C118.2 C119.2 C143.2 R68.1 R78.1 R80.1 R81.1 U6.2(GND) U6.6(NC_(GND)) U7.65(EXP) U9.5(GND) U9.10(~{OE}) U10.5(GND) U10.10(~{OE}) Y1.2 Y1.4
VCC3V3: C17.1 C20.1 C41.1 C42.1 C43.1 C118.1 C143.1 R74.1 R75.2 U6.3(VIN) U6.5(EN) U7.16(VDD3V3) U7.34(VDD3V3) U7.52(VDD3V3) U7.63(VDD3V3) U9.1(VCC) U10.1(VCC)
VCC5V: R73.2
BBbmConfigured0: TP24.1(GND) U7.40(BBbmConfigured0)
BBbmConfigured1: TP25.1(GND) U7.45(BBbmConfigured1)
BBEN: TP23.1(GND) U7.42(BBEN/GANGED,HS_UP)
CM4_OTG_ID: U10.2(Sel) ; port CM4_USB_HOST.CM4_OTG_ID, port USB_US.CM4_OTG_ID
CM4_USB_N: U10.4(D-) ; port CM4_USB_HOST.CM4_USB_N
CM4_USB_P: U10.3(D+) ; port CM4_USB_HOST.CM4_USB_P
CM4_USB_US_N: U7.54(US_DM) U10.6(HSD1-)
CM4_USB_US_P: U7.53(US_DP) U10.7(HSD1+)
DS1_D_N: U7.2(DS1_DM) ; port USB_DS.DS1_D_N
DS1_D_P: U7.1(DS1_DP) ; port USB_DS.DS1_D_P
DS2_D_N: U7.10(DS2_DM) ; port USB_DS.DS2_D_N
DS2_D_P: U7.9(DS2_DP) ; port USB_DS.DS2_D_P
DS3_D_N: U7.18(DS3_DM) U9.6(HSD1-)
DS3_D_P: U7.17(DS3_DP) U9.7(HSD1+)
DS4_D_N: U7.25(DS4_DM) ; port USB_DS.DS4_D_N
DS4_D_P: U7.24(DS4_DP) ; port USB_DS.DS4_D_P
JTAG_USB_D_N: U9.4(D-) ; port USB_JTAG.JTAG_USB_D_N
JTAG_USB_D_P: U9.3(D+) ; port USB_JTAG.JTAG_USB_D_P
SMBUSz: TP28.1(GND) U7.39(~{SMBUS},SS_SUSPEND)
USB_CM4Flash_N: U10.8(HSD2-) ; port USB_US.USB_CM4Flash_N
USB_CM4Flash_P: U10.9(HSD2+) ; port USB_US.USB_CM4Flash_P
USB_HUB_RST: C52.1 R75.1 U7.50(~{RESET})
USB_MUX_SEL: U9.2(Sel) ; port USB_US.USB_MUX_SEL
USB_OVRCURR: U7.43(~{DS_OC4}) U7.44(~{DS_OC3}) U7.46(~{DS_OC1}) U7.47(~{DS_OC2}) ; port USB_DS.USB_OVRCURR
USB_PWR_EN: D77.2 D78.2 D79.2 D80.2 ; port USB_DS.USB_PWR_EN
uUSB_N: U9.8(HSD2-) ; port USB_US.uUSB_N
uUSB_P: U9.9(HSD2+) ; port USB_US.uUSB_P
NetC53_2: C53.2 R82.1 U7.61(XTL_OUT) Y1.3
NetC54_2: C54.2 R82.2 U7.62(XTL_IN) Y1.1
NetC117_1: C117.1 R79.1 R81.2 U6.1(FB)
NetD77_1: D77.1 U7.36(DS_PE1)
NetD78_1: D78.1 U7.35(DS_PE2)
NetD79_1: D79.1 U7.33(DS_PE3)
NetD80_1: D80.1 U7.32(DS_PE4)
NetL9_2: L9.2 U6.4(SW)
NetR68_2: R68.2 R73.1 U7.48(VBUSDET0)
NetR74_2: R74.2 U7.41(PWRCTL_POL)
NetR78_2: R78.2 U7.64(RREF_SS)
NetR80_2: R80.2 U7.49(Test)
NetTP26_1: TP26.1(GND) U7.38(SCL/SMBCLK)
NetTP27_1: TP27.1(GND) U7.37(SDA/SMBDAT)

Not connected (* = marked no-connect by the designer): U7 3(DS1_TXP)* 4(DS1_TXM)* 6(DS1_RXP)* 7(DS1_RXM)* 11(DS2_TXP)* 12(DS2_TXM)* 14(DS2_RXP)* 15(DS2_RXM)* 19(DS3_TXP)* 20(DS3_TXM)* 22(DS3_RXP)* 23(DS3_RXM)* 26(DS4_TXP)* 27(DS4_TXM)* 29(DS4_RXP)* 30(DS4_RXM)* 55(US_TXP)* 56(US_TXM)* 58(US_RXP)* 59(US_RXM)* 60(NC)*

### Layout directives
net class USB_DS4: DS4_D_N, DS4_D_P
differential pair; net class Diff90: CM4_USB_N, CM4_USB_P, CM4_USB_US_N, CM4_USB_US_P, DS1_D_N, DS1_D_P, DS2_D_N, DS2_D_P, DS3_D_N, DS3_D_P, DS4_D_N, DS4_D_P, JTAG_USB_D_N, JTAG_USB_D_P, USB_CM4Flash_N, USB_CM4Flash_P, uUSB_N, uUSB_P
net class USB_DS3: DS3_D_N, DS3_D_P
net class USB_DS2: DS2_D_N, DS2_D_P
net class USB_DS1: DS1_D_N, DS1_D_P
net class µUSB_US: uUSB_N, uUSB_P
net class JTAG_USB: JTAG_USB_D_N, JTAG_USB_D_P
net class µUSB_Flash: USB_CM4Flash_N, USB_CM4Flash_P
net class CM4_USB_Host: CM4_USB_N, CM4_USB_P
net class CM4_USB_US: CM4_USB_US_N, CM4_USB_US_P

### Notes on the sheet
- 1V1-Powersupply
- (near TP7) Output: 1V1 at 2A
- Input: DC 3V3
- Company:
- Contact:
- Customer:
- mail@pcb-arts.com
- PCB Arts GmbH
- Title:
- Project:
- The  information  contained  in  these  documents  is  confidential,  privileged  and  only  for  the information of the intended recipient and may not be used, published or redistributed Without the prior written consent from PCB Arts GmbH.
- Engineer:
- Document Number:
- Revision:
- Variant:
- Date:
- Time:
- Sheet:
- Status:
- /
- (in symbol CAP_0402_1µF_16V) X7R; 0402
- (in symbol CAP_0402_12pF_50V) C0G; 0402
- (in symbol CAP_0402_100nF_50V) 0402; X7R
- (in symbol CAP_0603_10µF_6.3V) 0603; X5R
- (in symbol CAP_0805_22µF_16V) 0805; X5R
- (in symbol RES_0402_1M_1%) 0402
- (in symbol RES_0402_9.53k_1%) 0402
- (in symbol RES_0402_10k_1%) 0402
- (in symbol RES_0402_15k_1%) 0402
- (in symbol RES_0402_18k_1%) 0402
- (in symbol RES_0402_90.9k_1%) 0402

### Library data of the parts
C17 C20 C41-C51 C143 = CAP_0402_100nF_50V: as C88 on sheet SFP+_Connectors; Manufacturer 2: TDK
C52 = CAP_0402_1µF_16V: Multilayer Ceramic Capacitors MLCC - SMD/SMT 0402 16VDC; Manufacturer 1: Taiyo Yuden; Manufacturer 1 Prt. Nr.: EMK105BJ105MVHF; Manufacturer 2 Prt. Nr.: GRM155R61E105KA12D; Manufacturer 2: Murata Electronics
C53 C54 C117 = CAP_0402_12pF_50V: Multilayer Ceramic Capacitors MLCC - SMD/SMT 0402 50VDC; Manufacturer 1: Murata Electronics; Manufacturer 1 Prt. Nr.: GCM1555C1H120JA16J; Manufacturer 2 Prt. Nr.: C0402C120J5GACTU; Manufacturer 2: KEMET
C118 = CAP_0603_10µF_6.3V: Multilayer Ceramic Capacitors MLCC - SMD/SMT 0603 6.3VDC; Manufacturer 1: Murata Electronics; Manufacturer 1 Prt. Nr.: GRM188R60J106ME84J; Manufacturer 2 Prt. Nr.: JMK107ABJ106MA-T; Manufacturer 2: Taiyo Yuden
C119 = CAP_0805_22µF_16V: Multilayer Ceramic Capacitors MLCC - SMD/SMT 0805 16VDC; Manufacturer 1: Samsung Electro-Mechanics; Manufacturer 1 Prt. Nr.: CL21A226KOQNNNG; Manufacturer 2 Prt. Nr.: GRM21BC81C226ME44K; Manufacturer 2: Murata Electronics
D77-D80 = RB160QS-40_Schottky Dioden & Gleichrichter 40V: Schottky Dioden & Gleichrichter 40V SCHOTTKY DIODES & RECTIFIERS; Manufacturer 1: Rohm; Manufacturer 1 Prt. Nr.: RB160QS-40
L9 = 1uH 6A 27mΩ  FXL0420-1R0-M: 1uH ±20% 6A 27mΩ SMD,4.4x4.5x1.8mm Power Inductor; Manufacturer 1: cjiang(Changjiang Microelectronics Tech); Manufacturer 1 Prt. Nr.: FXL0420-1R0-M
R68 R74 R75 R80 = RES_0402_10k_1%: Thick Film Resistors - SMD 10kOhm 1%; Manufacturer 1: Vishay / Dale; Manufacturer 1 Prt. Nr.: CRCW040210K0FKEDC; Manufacturer 2 Prt. Nr.: RC0402FR-7W10KL; Manufacturer 2: Yageo
R73 = RES_0402_90.9k_1%: Thick Film Resistors - SMD 90.9k 1%; Manufacturer 1: Vishay / Dale; Manufacturer 1 Prt. Nr.: CRCW040290k9FKEDC; Manufacturer 2 Prt. Nr.: RC0402FR-7W90k9L; Manufacturer 2: Yageo
R78 = RES_0402_9.53k_1%: Thick Film Resistors - SMD 9.53kOhm 1%; Manufacturer 1: Panasonic; Manufacturer 1 Prt. Nr.: ERJ-2RKF9531X; Manufacturer 2 Prt. Nr.: RC0402FR-079K53L; Manufacturer 2: Yageo
R79 = RES_0402_15k_1%: Thick Film Resistors - SMD 15kOhm 1%; Manufacturer 1: Vishay / Dale; Manufacturer 1 Prt. Nr.: CRCW040215K0FKEDC; Manufacturer 2 Prt. Nr.: RC0402FR-1315KL; Manufacturer 2: Yageo
R81 = RES_0402_18k_1%: Thick Film Resistors - SMD 18kOhm 1%; Manufacturer 1: Vishay / Dale; Manufacturer 1 Prt. Nr.: CRCW040218K0FKEDC; Manufacturer 2 Prt. Nr.: RC0402FR-0718KL; Manufacturer 2: Yageo
R82 = RES_0402_1M_1%: Thick Film Resistors - SMD 1MOhm 1%; Manufacturer 1: Vishay / Dale; Manufacturer 1 Prt. Nr.: CRCW04021M00FKEDC; Manufacturer 2 Prt. Nr.: RC0402FR-071ML; Manufacturer 2: Yageo
TP7 TP23-TP28 = Testpoint 0.8mm
U6 = TLV62568ADRL_Step Down Converter 1A; 2A: Step Down Converter with Forced PWM in SOT563 Package; Manufacturer 1: Texas Instruments; Manufacturer 1 Prt. Nr.: TLV62568ADRL
U7 = TUSB8044AI_USB Hub IC, USB 3.2, 5Gbps, 4 Ports, industrial Temperature: USB Hub IC, USB 3.2, 5Gbps, 4 Ports, industrial Temperature; Manufacturer 1: Texas Instruments; Manufacturer 1 Prt. Nr.: TUSB8044AIRGCT
U9 U10 = FSUSB42MUX_IC USB SWITCH DPDT: IC USB SWITCH DPDT; Manufacturer 1: onsemi / Fairchild; Manufacturer 1 Prt. Nr.: FSUSB42MUX
Y1 = Quarz 24MHz ESR 50R10pF: 2.5 x 2.0 x 0.55 mm SMD Crystal; Manufacturer 1: ECS; Manufacturer 1 Prt. Nr.: ECS-240-10-36B2-CTN-TR

## Sheet Raspberry Pi CM4_Periphery.SchDoc
size A3; SheetNumber: 24; SheetTotal: 32
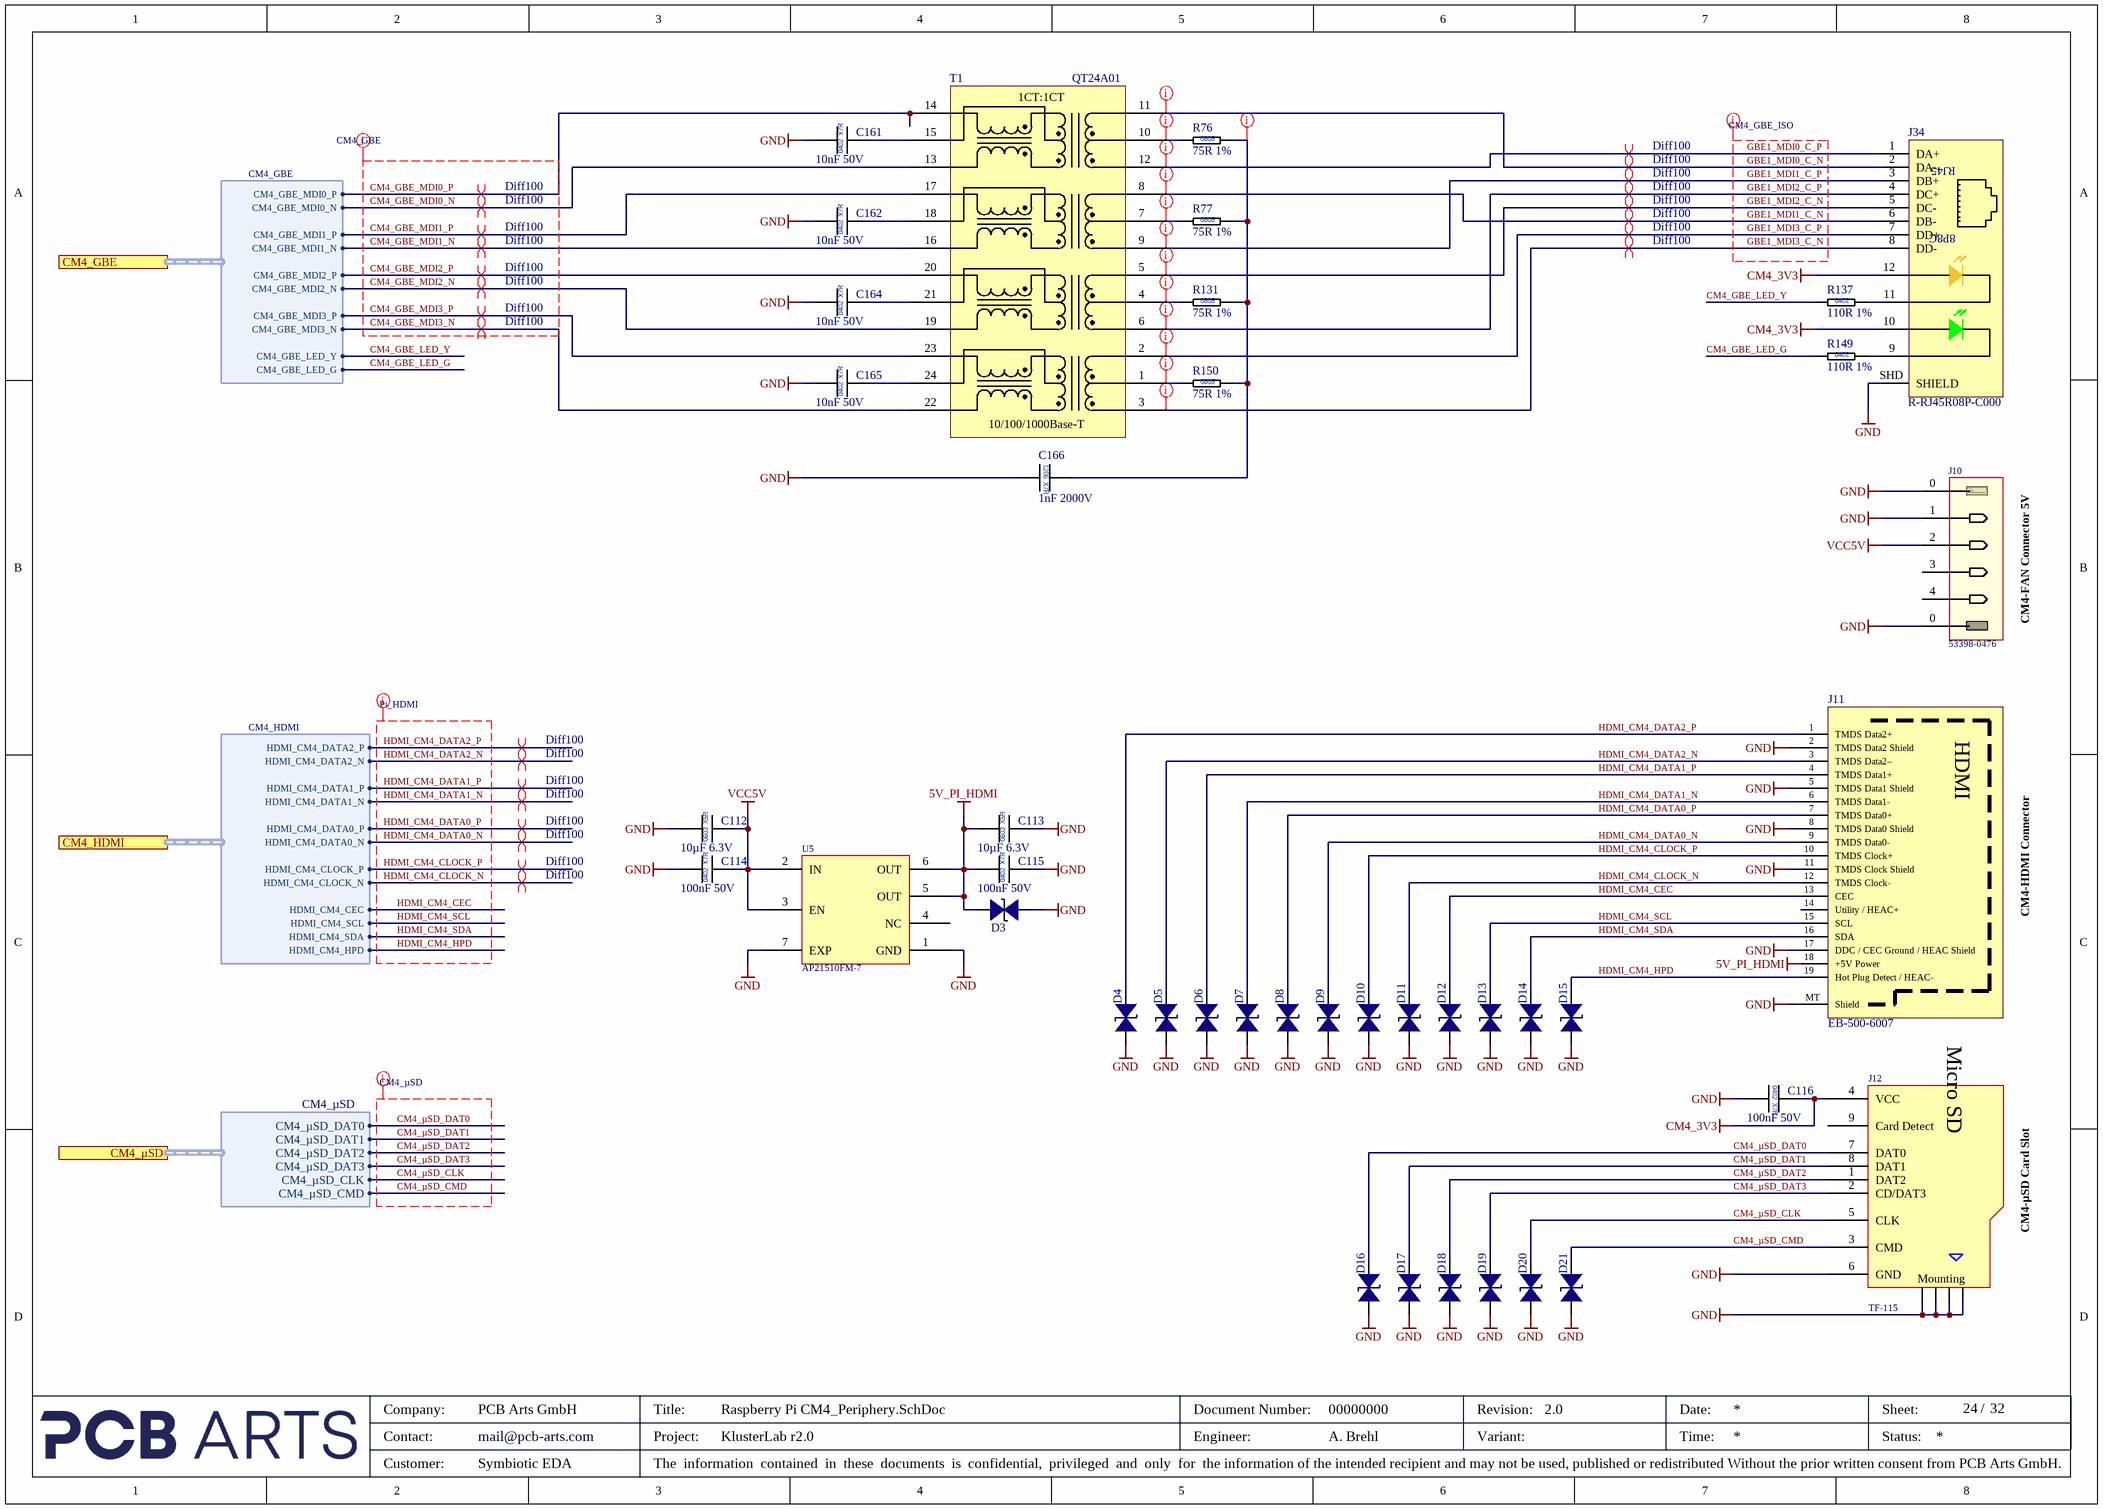
[diagram p13: Raspberry Pi CM4_Periphery.SchDoc]

### Parts
C112  10µF 6.3V  [CAP_0603_L]
C113  10µF 6.3V  [CAP_0603_L]
C114  100nF 50V  [CAP_0402_L]
C115  100nF 50V  [CAP_0402_L]
C116  100nF 50V  [CAP_0402_L]
C161  10nF 50V  [CAP_0402_L]
C162  10nF 50V  [CAP_0402_L]
C164  10nF 50V  [CAP_0402_L]
C165  10nF 50V  [CAP_0402_L]
C166  1nF 2000V  [CAP_1206]
D3  CESDP0402UC5VB  [TVS_0402]  (value not drawn)
D4  CESDP0402UC5VB  [TVS_0402]  (value not drawn)
D5  CESDP0402UC5VB  [TVS_0402]  (value not drawn)
D6  CESDP0402UC5VB  [TVS_0402]  (value not drawn)
D7  CESDP0402UC5VB  [TVS_0402]  (value not drawn)
D8  CESDP0402UC5VB  [TVS_0402]  (value not drawn)
D9  CESDP0402UC5VB  [TVS_0402]  (value not drawn)
D10  CESDP0402UC5VB  [TVS_0402]  (value not drawn)
D11  CESDP0402UC5VB  [TVS_0402]  (value not drawn)
D12  CESDP0402UC5VB  [TVS_0402]  (value not drawn)
D13  CESDP0402UC5VB  [TVS_0402]  (value not drawn)
D14  CESDP0402UC5VB  [TVS_0402]  (value not drawn)
D15  CESDP0402UC5VB  [TVS_0402]  (value not drawn)
D16  CESDP0402UC5VB  [TVS_0402]  (value not drawn)
D17  CESDP0402UC5VB  [TVS_0402]  (value not drawn)
D18  CESDP0402UC5VB  [TVS_0402]  (value not drawn)
D19  CESDP0402UC5VB  [TVS_0402]  (value not drawn)
D20  CESDP0402UC5VB  [TVS_0402]  (value not drawn)
D21  CESDP0402UC5VB  [TVS_0402]  (value not drawn)
J10  53398-0476  [Molex 53398-0476]
J11  EB-500-6007  [Elecbee EB-500-6007]
J12  TF-115  [TF-115]
J34  R-RJ45R08P-C000  [Ckmtw - R-RJ45R08P-C000]
R76  75R 1%  [RES_0805]
R77  75R 1%  [RES_0805]
R131  75R 1%  [RES_0805]
R137  110R 1%  [RES_0402_L]
R149  110R 1%  [RES_0402_L]
R150  75R 1%  [RES_0805]
T1  QT24A01  [QT24A01]
U5  AP21510FM-7  [QFN50P201X181X60_HS-7N]

### Ports
CM4_GBE (harness CM4_GBE, see Top-Level-Sheet[3C], Raspberry Pi CM4[8A]), CM4_HDMI (harness CM4_HDMI, see Top-Level-Sheet[3C], Raspberry Pi CM4[8B]), CM4_µSD (harness CM4_µSD, see Top-Level-Sheet[3C], Raspberry Pi CM4[8C])

### Harnesses
CM4_GBE: CM4_GBE_MDI0_P, CM4_GBE_MDI0_N, CM4_GBE_MDI1_P, CM4_GBE_MDI1_N, CM4_GBE_MDI2_P, CM4_GBE_MDI2_N, CM4_GBE_MDI3_P, CM4_GBE_MDI3_N, CM4_GBE_LED_Y, CM4_GBE_LED_G
CM4_HDMI: HDMI_CM4_DATA2_P, HDMI_CM4_DATA2_N, HDMI_CM4_DATA1_P, HDMI_CM4_DATA1_N, HDMI_CM4_DATA0_P, HDMI_CM4_DATA0_N, HDMI_CM4_CLOCK_P, HDMI_CM4_CLOCK_N, HDMI_CM4_CEC, HDMI_CM4_SCL, HDMI_CM4_SDA, HDMI_CM4_HPD
CM4_µSD: CM4_µSD_DAT1, CM4_µSD_DAT2, CM4_µSD_DAT3, CM4_µSD_CLK, CM4_µSD_DAT0, CM4_µSD_CMD

### Nets
5V_PI_HDMI: C113.1 C115.1 D3.1 J11.18(+5V_Power) U5.5(OUT) U5.6(OUT)
CM4_3V3: C116.1 J12.4(VCC) J34.10 J34.12
GND: C112.1 C113.2 C114.1 C115.2 C116.2 C161.1 C162.1 C164.1 C165.1 C166.2 D3.2 D4.1 D5.1 D6.1 D7.1 D8.1 D9.1 D10.1 D11.1 D12.1 D13.1 D14.1 D15.1 D16.1 D17.1 D18.1 D19.1 D20.1 D21.1 J10.0 J10.1 J11.2(TMDS_Data2_Shield) J11.5(TMDS_Data1_Shield) J11.8(TMDS_Data0_Shield) J11.11(TMDS_Clock_Shield) J11.17(DDC_/_CEC_Ground_/_HEAC_Shield) J11.MT(Shield) J12.6(GND) J12.10 J12.11 J12.12 J12.13 J34.SHD(SHIELD) U5.1(GND) U5.7(EXP)
VCC5V: C112.2 C114.2 J10.2 U5.2(IN) U5.3(EN)
CM4_GBE_LED_G: R149.1 ; port CM4_GBE.CM4_GBE_LED_G
CM4_GBE_LED_Y: R137.1 ; port CM4_GBE.CM4_GBE_LED_Y
CM4_GBE_MDI0_N: T1.13(MX4-) ; port CM4_GBE.CM4_GBE_MDI0_N
CM4_GBE_MDI0_P: T1.14(MX4+) ; port CM4_GBE.CM4_GBE_MDI0_P
CM4_GBE_MDI1_N: T1.16(MX3-) ; port CM4_GBE.CM4_GBE_MDI1_N
CM4_GBE_MDI1_P: T1.17(MX3+) ; port CM4_GBE.CM4_GBE_MDI1_P
CM4_GBE_MDI2_N: T1.19(MX2-) ; port CM4_GBE.CM4_GBE_MDI2_N
CM4_GBE_MDI2_P: T1.20(MX2+) ; port CM4_GBE.CM4_GBE_MDI2_P
CM4_GBE_MDI3_N: T1.22(MX1-) ; port CM4_GBE.CM4_GBE_MDI3_N
CM4_GBE_MDI3_P: T1.23(MX1+) ; port CM4_GBE.CM4_GBE_MDI3_P
CM4_µSD_CLK: D20.2 J12.5(CLK) ; port CM4_µSD.CM4_µSD_CLK
CM4_µSD_CMD: D21.2 J12.3(CMD) ; port CM4_µSD.CM4_µSD_CMD
CM4_µSD_DAT0: D16.2 J12.7(DAT0) ; port CM4_µSD.CM4_µSD_DAT0
CM4_µSD_DAT1: D17.2 J12.8(DAT1) ; port CM4_µSD.CM4_µSD_DAT1
CM4_µSD_DAT2: D18.2 J12.1(DAT2) ; port CM4_µSD.CM4_µSD_DAT2
CM4_µSD_DAT3: D19.2 J12.2(CD/DAT3) ; port CM4_µSD.CM4_µSD_DAT3
GBE1_MDI0_C_N: J34.2(DA-) T1.11(TD4+)
GBE1_MDI0_C_P: J34.1(DA+) T1.12(TD4-)
GBE1_MDI1_C_N: J34.6(DB-) T1.8(TD3+)
GBE1_MDI1_C_P: J34.3(DB+) T1.9(TD3-)
GBE1_MDI2_C_N: J34.5(DC-) T1.5(TD2+)
GBE1_MDI2_C_P: J34.4(DC+) T1.6(TD2-)
GBE1_MDI3_C_N: J34.8(DD-) T1.3(TD1-)
GBE1_MDI3_C_P: J34.7(DD+) T1.2(TD1+)
HDMI_CM4_CEC: D12.2 J11.13(CEC) ; port CM4_HDMI.HDMI_CM4_CEC
HDMI_CM4_CLOCK_N: D11.2 J11.12(TMDS_Clock-) ; port CM4_HDMI.HDMI_CM4_CLOCK_N
HDMI_CM4_CLOCK_P: D10.2 J11.10(TMDS_Clock+) ; port CM4_HDMI.HDMI_CM4_CLOCK_P
HDMI_CM4_DATA0_N: D9.2 J11.9(TMDS_Data0-) ; port CM4_HDMI.HDMI_CM4_DATA0_N
HDMI_CM4_DATA0_P: D8.2 J11.7(TMDS_Data0+) ; port CM4_HDMI.HDMI_CM4_DATA0_P
HDMI_CM4_DATA1_N: D7.2 J11.6(TMDS_Data1-) ; port CM4_HDMI.HDMI_CM4_DATA1_N
HDMI_CM4_DATA1_P: D6.2 J11.4(TMDS_Data1+) ; port CM4_HDMI.HDMI_CM4_DATA1_P
HDMI_CM4_DATA2_N: D5.2 J11.3(TMDS_Data2–) ; port CM4_HDMI.HDMI_CM4_DATA2_N
HDMI_CM4_DATA2_P: D4.2 J11.1(TMDS_Data2+) ; port CM4_HDMI.HDMI_CM4_DATA2_P
HDMI_CM4_HPD: D15.2 J11.19(Hot_Plug_Detect_/_HEAC-) ; port CM4_HDMI.HDMI_CM4_HPD
HDMI_CM4_SCL: D13.2 J11.15(SCL) ; port CM4_HDMI.HDMI_CM4_SCL
HDMI_CM4_SDA: D14.2 J11.16(SDA) ; port CM4_HDMI.HDMI_CM4_SDA
NetC161_2: C161.2 T1.15(MCT4)
NetC162_2: C162.2 T1.18(MCT3)
NetC164_2: C164.2 T1.21(MCT2)
NetC165_2: C165.2 T1.24(MCT1)
NetC166_1: C166.1 R76.2 R77.2 R131.2 R150.2
NetJ34_9: J34.9 R149.2
NetJ34_11: J34.11 R137.2
NetR76_1: R76.1 T1.10(TCT4)
NetR77_1: R77.1 T1.7(TCT3)
NetR131_1: R131.1 T1.4(TCT2)
NetR150_1: R150.1 T1.1(TCT1)

Not connected (* = marked no-connect by the designer): J10 3 4; J11 14(Utility_/_HEAC+); J12 9(Card_Detect); U5 4(NC)

### Layout directives
net class CM4_GBE: CM4_GBE_MDI0_N, CM4_GBE_MDI0_P, CM4_GBE_MDI1_N, CM4_GBE_MDI1_P, CM4_GBE_MDI2_N, CM4_GBE_MDI2_P, CM4_GBE_MDI3_N, CM4_GBE_MDI3_P
differential pair; net class Diff100: CM4_GBE_MDI0_N, CM4_GBE_MDI0_P, CM4_GBE_MDI1_N, CM4_GBE_MDI1_P, CM4_GBE_MDI2_N, CM4_GBE_MDI2_P, CM4_GBE_MDI3_N, CM4_GBE_MDI3_P, GBE1_MDI0_C_N, GBE1_MDI0_C_P, GBE1_MDI1_C_N, GBE1_MDI1_C_P, GBE1_MDI2_C_N, GBE1_MDI2_C_P, GBE1_MDI3_C_N, GBE1_MDI3_C_P, HDMI_CM4_CLOCK_N, HDMI_CM4_CLOCK_P, HDMI_CM4_DATA0_N, HDMI_CM4_DATA0_P, HDMI_CM4_DATA1_N, HDMI_CM4_DATA1_P, HDMI_CM4_DATA2_N, HDMI_CM4_DATA2_P
net class Pi_HDMI: HDMI_CM4_CEC, HDMI_CM4_CLOCK_N, HDMI_CM4_CLOCK_P, HDMI_CM4_DATA0_N, HDMI_CM4_DATA0_P, HDMI_CM4_DATA1_N, HDMI_CM4_DATA1_P, HDMI_CM4_DATA2_N, HDMI_CM4_DATA2_P, HDMI_CM4_HPD, HDMI_CM4_SCL, HDMI_CM4_SDA
net class CM4_µSD: CM4_µSD_CLK, CM4_µSD_CMD, CM4_µSD_DAT0, CM4_µSD_DAT1, CM4_µSD_DAT2, CM4_µSD_DAT3
net class CM4_GBE_ISO: GBE1_MDI0_C_N, GBE1_MDI0_C_P, GBE1_MDI1_C_N, GBE1_MDI1_C_P, GBE1_MDI2_C_N, GBE1_MDI2_C_P, GBE1_MDI3_C_N, GBE1_MDI3_C_P, NetC166_1, NetR76_1, NetR77_1, NetR131_1, NetR150_1

### Notes on the sheet
- CM4-FAN Connector 5V
- CM4-HDMI Connector
- CM4-µSD Card Slot
- Company:
- Contact:
- Customer:
- mail@pcb-arts.com
- PCB Arts GmbH
- Title:
- Project:
- The  information  contained  in  these  documents  is  confidential,  privileged  and  only  for  the information of the intended recipient and may not be used, published or redistributed Without the prior written consent from PCB Arts GmbH.
- Engineer:
- Document Number:
- Revision:
- Variant:
- Date:
- Time:
- Sheet:
- Status:
- /
- (in symbol CAP_0402_10nF_50V) X7R; 0402
- (in symbol CAP_0402_100nF_50V) X7R; 0402
- (in symbol CAP_0603_10µF_6.3V) X5R; 0603
- (in symbol CAP_1206_1nF_2000V) 1206; X7R
- (in symbol EB-500-6007_HDMI Connector 19Pin Vertical THT) HDMI
- (in symbol QT24A01_10/100/1000Base-T  Single  Port  Transformer) 1CT:1CT; 10/100/1000Base-T
- (in symbol R-RJ45R08P-C000_RJ45 8P8C Shielded Yellow - Green Through Hole Ethernet Connectors) RJ45; 8P8C
- (in symbol RES_0402_110R_1%) 0402
- (in symbol RES_0805_75R_1%) 0805
- (in symbol TF-115_microSD™ Memory Card 8 connector) Micro SD; Mounting

### Library data of the parts
C112 C113 = CAP_0603_10µF_6.3V: as C118 on sheet USB-HUB-MUX; Manufacturer 2: Taiyo Yuden
C114-C116 = CAP_0402_100nF_50V: as C88 on sheet SFP+_Connectors; Manufacturer 2: TDK
C161 C162 C164 C165 = CAP_0402_10nF_50V: Multilayer Ceramic Capacitors MLCC - SMD/SMT 0402 50VDC; Manufacturer 1: Wurth Elektronik; Manufacturer 1 Prt. Nr.: 885012205067; Manufacturer 2 Prt. Nr.: AC0402KPX7R9BB103; Manufacturer 2: Yageo
C166 = CAP_1206_1nF_2000V: Multilayer Ceramic Capacitors MLCC - SMD/SMT 1206 2000VDC; Manufacturer 1: Yageo; Manufacturer 1 Prt. Nr.: CC1206MKX7RDBB102; Manufacturer 2 Prt. Nr.: 1206B102M202CT; Manufacturer 2: Walsin
D3-D21 = CESDP0402UC5VB_TVS Diode 0402: Low Capacitance ESD Protection Diode 0402; Manufacturer 1: CREATEK; Manufacturer 2 Prt. Nr.: BPESD0402-05ST; Manufacturer 1 Prt. Nr.: CESDP0402UC5VB; Manufacturer 2: BORN
J10 = 53398-0476_1.25mm Pitch, PicoBlade PCB Header, Single Row, horizontal, SMD, 4 Pin: 1.25mm Pitch, PicoBlade PCB Header, Single Row, horizontal, SMD, 4 Pin; Manufacturer 1: Molex; Manufacturer 2 Prt. Nr.: 53398-0471; Manufacturer 1 Prt. Nr.: 53398-0476; Manufacturer 2: Molex
J11 = EB-500-6007_HDMI Connector 19Pin Vertical THT: HDMI Connector Female Vertical 19 Pin; Manufacturer 1: Elecbee; Manufacturer 1 Prt. Nr.: EB-500-6007
J12 = TF-115_microSD™ Memory Card 8 connector: microSD™ Memory Card 8 connector&Ejector 14.5x14.75x1.85mm Card Sockets Connector; Manufacturer 1: XUNPU; Manufacturer 1 Prt. Nr.: TF-115
J34 = R-RJ45R08P-C000_RJ45 8P8C Shielded Yellow - Green Through Hole Ethernet Connectors: RJ45 8 1 Shielded Yellow - Green Through Hole Ethernet Connectors/Modular Connectors (RJ45 RJ11) RoHS; Manufacturer 1: Ckmtw(Shenzhen Cankemeng); Manufacturer 1 Prt. Nr.: R-RJ45R08P-C000
R76 R77 R131 R150 = RES_0805_75R_1%: Thick Film Resistors - SMD 75Ohm 1%; Manufacturer 1: Bourns; Manufacturer 1 Prt. Nr.: CR0805-FX-75R0ELF; Manufacturer 2 Prt. Nr.: ERJ-6ENF75R0V; Manufacturer 2: Panasonic
R137 R149 = RES_0402_110R_1%: as R275 on sheet SFP+_Connectors; Manufacturer 2: Yageo
T1 = QT24A01_10/100/1000Base-T  Single  Port  Transformer: 1:1 350 28 1.2 -1 -16 SMD,24PIN RJ45 Transformer RoHS; Manufacturer 1: TNK; Manufacturer 1 Prt. Nr.: QT24A01
U5 = AP21510FM-7_Power Switch ICs - Power Distribution Load Switch: Power Switch ICs - Power Distribution 0.5A SGL Ch USB 2.0 Curr Limited Switch; Manufacturer 1: Diodes Incorporated; Manufacturer 1 Prt. Nr.: AP21510FM-7

## Sheet I2C Multiplexer.SchDoc
size A3
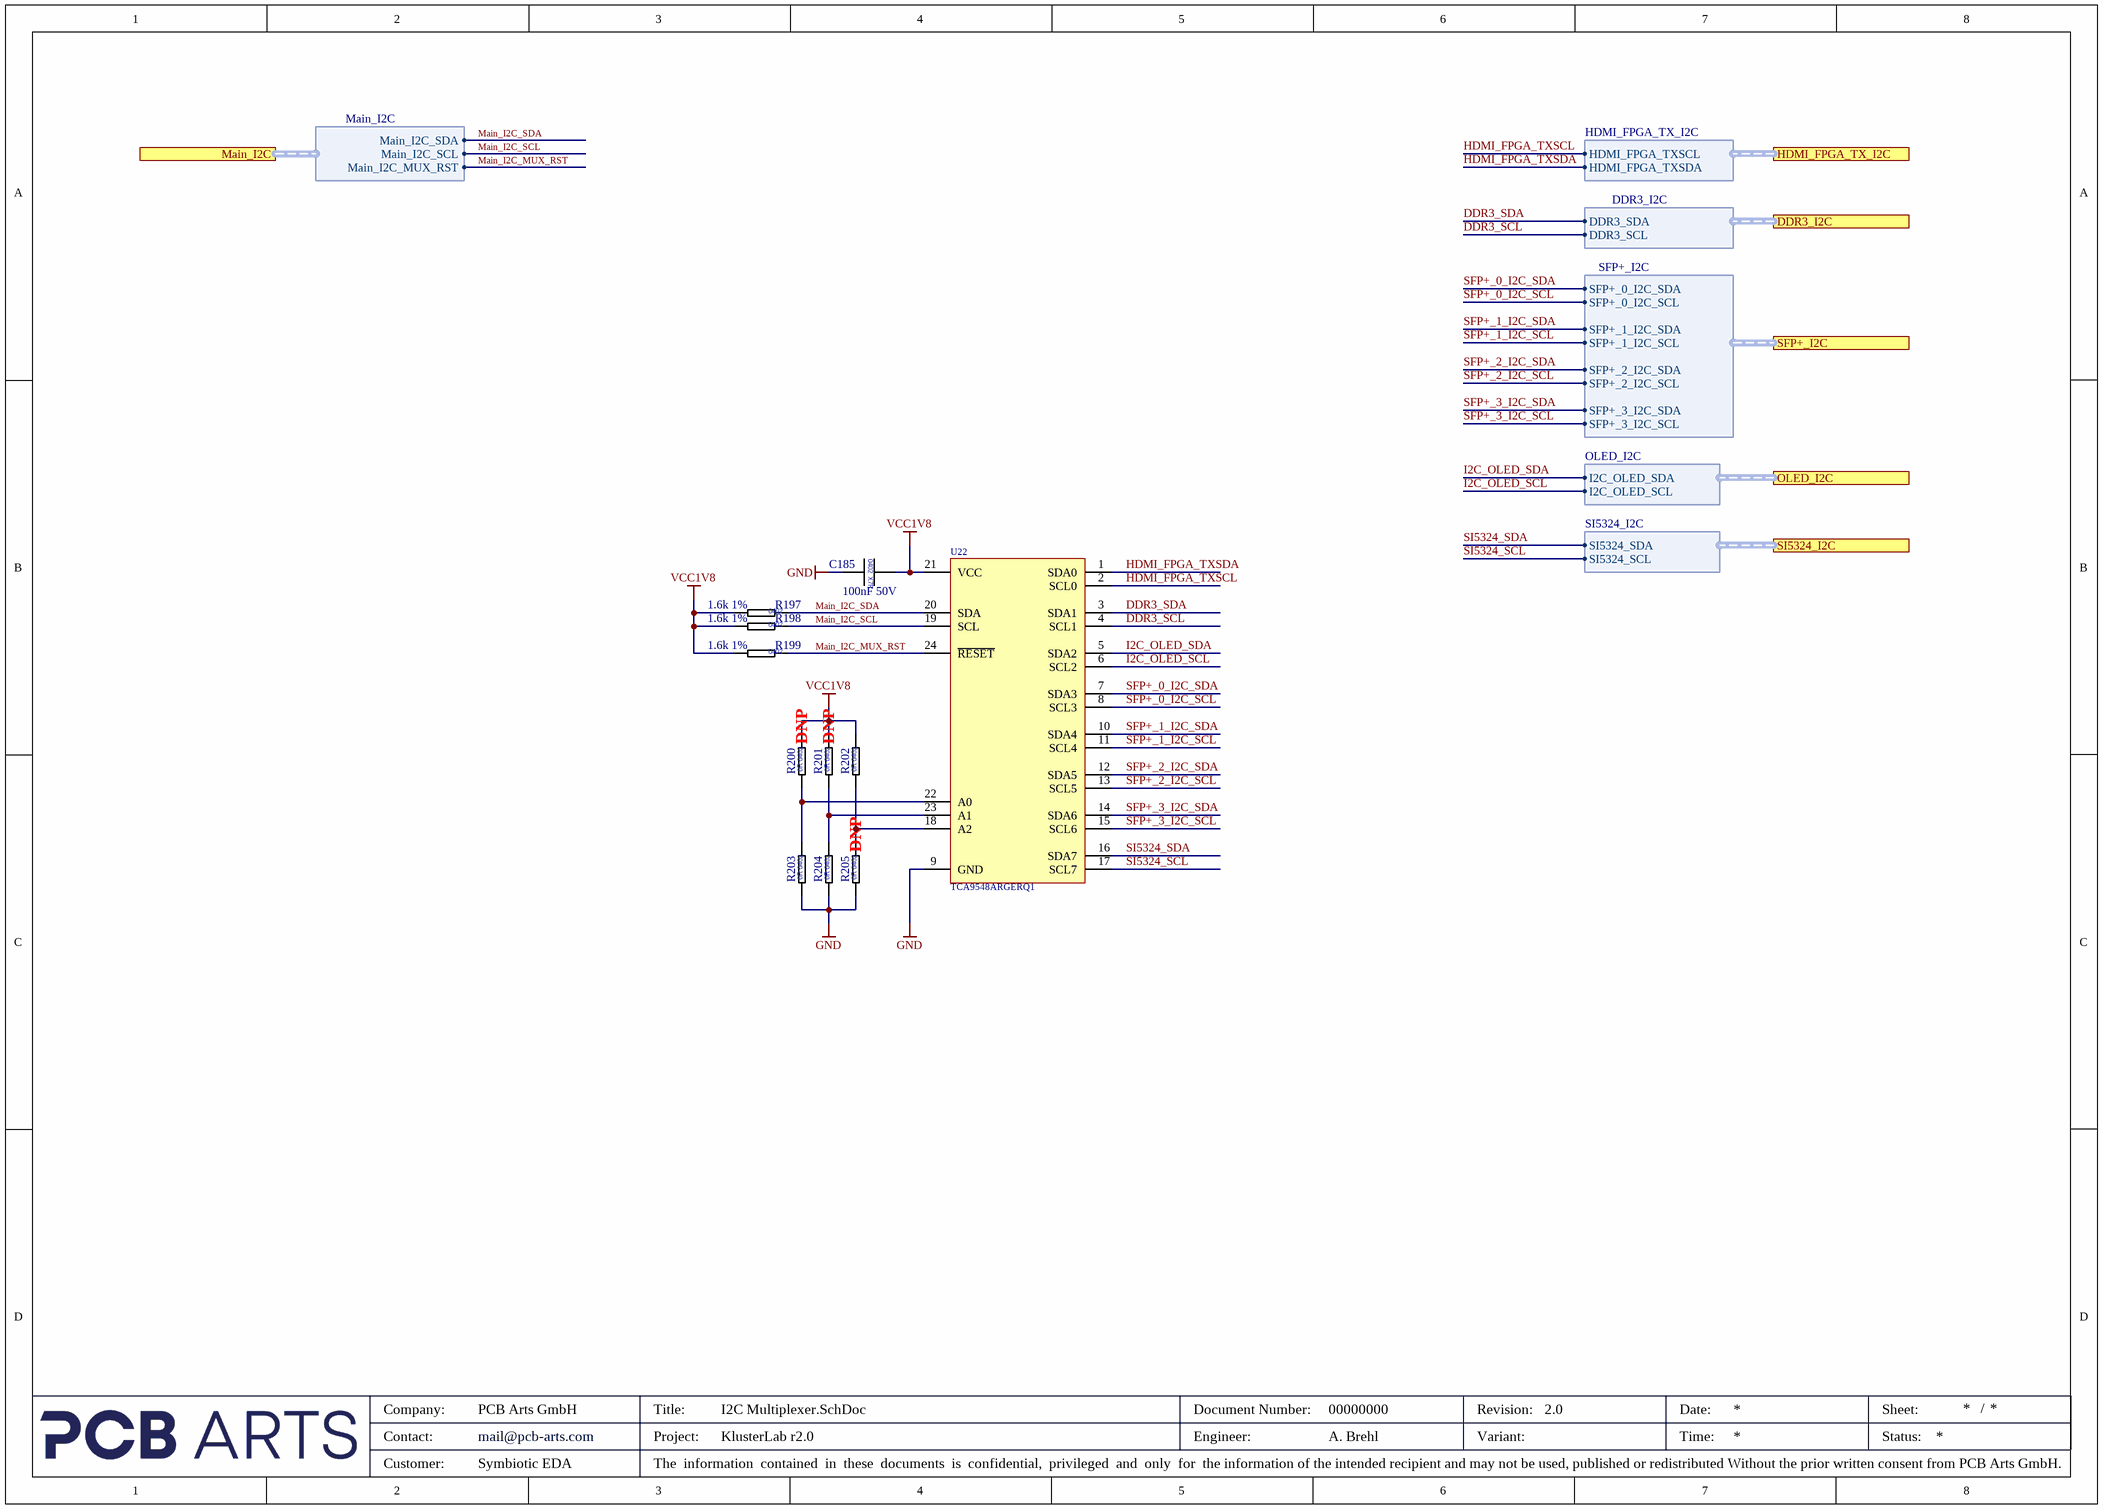
[diagram p14: I2C Multiplexer.SchDoc]

### Parts
C185  100nF 50V  [CAP_0402_L]
R197  1.6k 1%  [RES_0402_L]
R198  1.6k 1%  [RES_0402_L]
R199  1.6k 1%  [RES_0402_L]
R200  0R Jumper  [RES_0402_L]  (value not drawn)  (no BOM)
R201  0R Jumper  [RES_0402_L]  (value not drawn)  (no BOM)
R202  0R Jumper  [RES_0402_L]  (value not drawn)
R203  0R Jumper  [RES_0402_L]  (value not drawn)
R204  0R Jumper  [RES_0402_L]  (value not drawn)
R205  0R Jumper  [RES_0402_L]  (value not drawn)  (no BOM)
U22  TCA9548ARGERQ1  [QFN50P400X400X100-25N]

### Ports
DDR3_I2C (harness DDR3_I2C, see Top-Level-Sheet[6C], DDR3 Memory_SO-DIMM[8C]), HDMI_FPGA_TX_I2C (harness HDMI_FPGA_TX_I2C, see Top-Level-Sheet[6C], Bank 13_Bank 15_Bank 16[8C]), Main_I2C (harness Main_I2C, see Top-Level-Sheet[6C], SMI Bank 12[1B]), OLED_I2C (harness OLED_I2C, see Top-Level-Sheet[6C], HMI[1A]), SFP+_I2C (harness SFP+_I2C, see Top-Level-Sheet[6C], SFP+_Connectors[8B]), SI5324_I2C (harness SI5324_I2C, see Top-Level-Sheet[6C], System Clocks[1A])

### Harnesses
HDMI_FPGA_TX_I2C: HDMI_FPGA_TXSCL, HDMI_FPGA_TXSDA
DDR3_I2C: DDR3_SDA, DDR3_SCL
SFP+_I2C: SFP+_3_I2C_SDA, SFP+_3_I2C_SCL, SFP+_0_I2C_SDA, SFP+_0_I2C_SCL, SFP+_1_I2C_SDA, SFP+_1_I2C_SCL, SFP+_2_I2C_SDA, SFP+_2_I2C_SCL
OLED_I2C: I2C_OLED_SDA, I2C_OLED_SCL
Main_I2C: Main_I2C_SCL, Main_I2C_MUX_RST, Main_I2C_SDA
SI5324_I2C: SI5324_SDA, SI5324_SCL

### Nets
GND: C185.2 R203.1 R204.1 R205.1 U22.9(GND)
VCC1V8: C185.1 R197.2 R198.2 R199.2 R200.2 R201.2 R202.2 U22.21(VCC)
DDR3_SCL: U22.4(SCL1) ; port DDR3_I2C.DDR3_SCL
DDR3_SDA: U22.3(SDA1) ; port DDR3_I2C.DDR3_SDA
HDMI_FPGA_TXSCL: U22.2(SCL0) ; port HDMI_FPGA_TX_I2C.HDMI_FPGA_TXSCL
HDMI_FPGA_TXSDA: U22.1(SDA0) ; port HDMI_FPGA_TX_I2C.HDMI_FPGA_TXSDA
I2C_OLED_SCL: U22.6(SCL2) ; port OLED_I2C.I2C_OLED_SCL
I2C_OLED_SDA: U22.5(SDA2) ; port OLED_I2C.I2C_OLED_SDA
Main_I2C_MUX_RST: R199.1 U22.24(~{RESET}) ; port Main_I2C.Main_I2C_MUX_RST
Main_I2C_SCL: R198.1 U22.19(SCL) ; port Main_I2C.Main_I2C_SCL
Main_I2C_SDA: R197.1 U22.20(SDA) ; port Main_I2C.Main_I2C_SDA
SFP+_0_I2C_SCL: U22.8(SCL3) ; port SFP+_I2C.SFP+_0_I2C_SCL
SFP+_0_I2C_SDA: U22.7(SDA3) ; port SFP+_I2C.SFP+_0_I2C_SDA
SFP+_1_I2C_SCL: U22.11(SCL4) ; port SFP+_I2C.SFP+_1_I2C_SCL
SFP+_1_I2C_SDA: U22.10(SDA4) ; port SFP+_I2C.SFP+_1_I2C_SDA
SFP+_2_I2C_SCL: U22.13(SCL5) ; port SFP+_I2C.SFP+_2_I2C_SCL
SFP+_2_I2C_SDA: U22.12(SDA5) ; port SFP+_I2C.SFP+_2_I2C_SDA
SFP+_3_I2C_SCL: U22.15(SCL6) ; port SFP+_I2C.SFP+_3_I2C_SCL
SFP+_3_I2C_SDA: U22.14(SDA6) ; port SFP+_I2C.SFP+_3_I2C_SDA
SI5324_SCL: U22.17(SCL7) ; port SI5324_I2C.SI5324_SCL
SI5324_SDA: U22.16(SDA7) ; port SI5324_I2C.SI5324_SDA
NetR200_1: R200.1 R203.2 U22.22(A0)
NetR201_1: R201.1 R204.2 U22.23(A1)
NetR202_1: R202.1 R205.2 U22.18(A2)

### Notes on the sheet
- (near R200) DNP
- (near R201) DNP
- (near R205) DNP
- Company:
- Contact:
- Customer:
- mail@pcb-arts.com
- PCB Arts GmbH
- Title:
- Project:
- The  information  contained  in  these  documents  is  confidential,  privileged  and  only  for  the information of the intended recipient and may not be used, published or redistributed Without the prior written consent from PCB Arts GmbH.
- Engineer:
- Document Number:
- Revision:
- Variant:
- Date:
- Time:
- Sheet:
- Status:
- /
- (in symbol CAP_0402_100nF_50V) 0402; X7R
- (in symbol RES_0402_0R Jumper) 0R 0402
- (in symbol RES_0402_1.6k_1%) 0402

### Library data of the parts
C185 = CAP_0402_100nF_50V: as C88 on sheet SFP+_Connectors; Manufacturer 2: TDK
R197-R199 = RES_0402_1.6k_1%: as R87-R90 on sheet SMI Bank 12; Manufacturer 2: Yageo
R200-R205 = RES_0402_0R Jumper: Thick Film Resistors - SMD 0Ohm; Manufacturer 1: Vishay / Dale; Manufacturer 1 Prt. Nr.: CRCW04020000Z0EDC; Manufacturer 2 Prt. Nr.: RC0402JR-070RL; Manufacturer 2: Yageo
U22 = TCA9548ARGERQ1_8-Channel I2C Switch with Reset: Automotive 8-Channel I2C Switch with Reset; Manufacturer 1: Texas Instruments; Manufacturer 1 Prt. Nr.: TCA9548ARGERQ1